# EAGLE design Audio Spektrum Analyser (EAGLE 9.0.1)
ERSTELLER: Jakob Holz; PROJEKT: Audio Spektrumanalysator; VERSION: 1.0

## Sheet 1 of 5
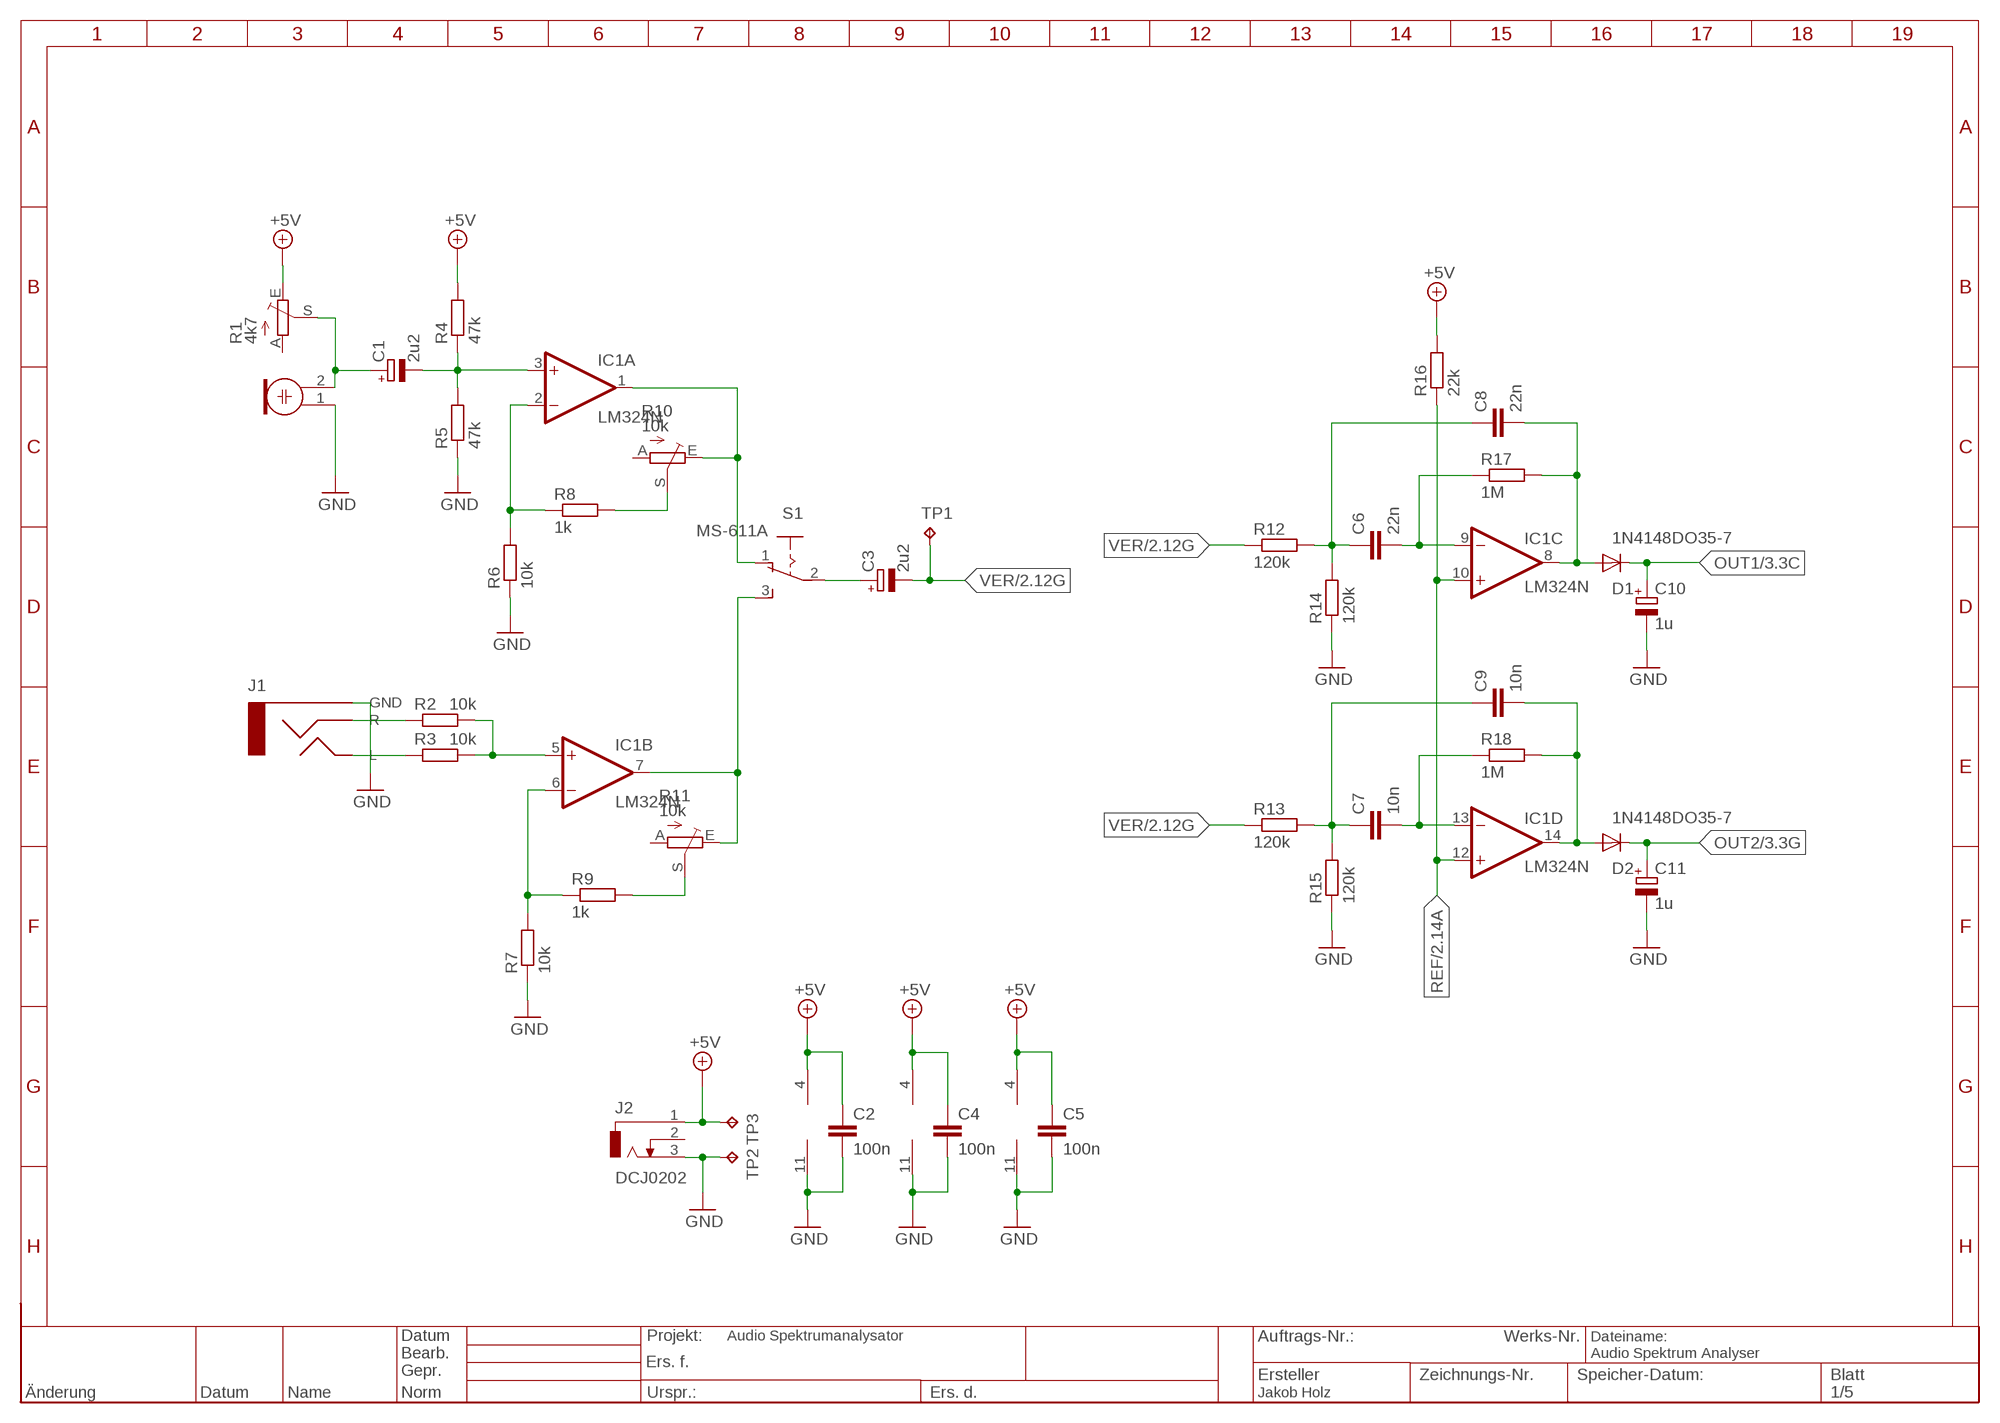
[diagram p0: schematic, sheet 1]

### Parts
C1  2u2  CPOL-EUE2.5-5  [E2,5-5]
C2  100n  C-EU050-024X044  [C050-024X044]
C3  2u2  CPOL-EUE2.5-5  [E2,5-5]
C4  100n  C-EU050-024X044  [C050-024X044]
C5  100n  C-EU050-024X044  [C050-024X044]
C6  22n  C-EU025-024X044  [C025-024X044]
C7  10n  C-EU025-024X044  [C025-024X044]
C8  22n  C-EU025-024X044  [C025-024X044]
C9  10n  C-EU025-024X044  [C025-024X044]
C10  1u  CPOL-EUE2.5-5  [E2,5-5]
C11  1u  CPOL-EUE2.5-5  [E2,5-5]
D1  1N4148DO35-7  [DO35-7]
D2  1N4148DO35-7  [DO35-7]
IC1  LM324N  [DIL14]
IC2  LM324N  [DIL14]
IC3  LM324N  [DIL14]
J1  2.5MM-AUXPC  [2.5MM-AUX_PC]
J2  DCJ0202  [DCJ0202]
M1  ELECTRET_MICROPHON-F6050AP  [F6050AP]
R1  4k7  TRIM_EU-CA6V  [CA6V]
R2  10k  R-EU_0207/7  [0207/7]
R3  10k  R-EU_0207/7  [0207/7]
R4  47k  R-EU_0207/7  [0207/7]
R5  47k  R-EU_0207/7  [0207/7]
R6  10k  R-EU_0207/7  [0207/7]
R7  10k  R-EU_0207/7  [0207/7]
R8  1k  R-EU_0207/7  [0207/7]
R9  1k  R-EU_0207/7  [0207/7]
R10  10k  TRIM_EU-CA6V  [CA6V]
R11  10k  TRIM_EU-CA6V  [CA6V]
R12  120k  R-EU_0207/7  [0207/7]
R13  120k  R-EU_0207/7  [0207/7]
R14  120k  R-EU_0207/7  [0207/7]
R15  120k  R-EU_0207/7  [0207/7]
R16  22k  R-EU_0207/7  [0207/7]
R17  1M  R-EU_0207/7  [0207/7]
R18  1M  R-EU_0207/7  [0207/7]
S1  MS-611A  [MS-611A]
TP1  TPPAD1-20  [P1-20]
TP2  TPPAD1-20  [P1-20]
TP3  TPPAD1-20  [P1-20]

### Nets
+5V: C2.1 C4.1 C5.1 IC1.4(P:V+) IC2.4(P:V+) IC3.4(P:V+) J2.1 R1.E R4.2 R16.2 TP3.TP ; also sheet 3,4,5
GND: C2.2 C4.2 C5.2 C10.- C11.- IC1.11(P:V-) IC2.11(P:V-) IC3.11(P:V-) J1.1(GND) J2.3 M1.1 R5.1 R6.1 R7.1 R14.1 R15.1 TP2.TP ; also sheet 2,3,4,5
N$1: J1.4(R) R2.1
N$2: J1.2(L) R3.1
N$3: IC1.5(B:+IN) R2.2 R3.2
N$4: C1.- IC1.3(A:+IN) R4.1 R5.2
N$5: IC1.2(A:-IN) R6.2 R8.1
N$6: IC1.1(A:OUT) R10.E S1.1
N$10: IC1.7(B:OUT) R11.E S1.3
N$12: C3.+ S1.2
N$13: C1.+ M1.2 R1.S
N$31: R8.2 R10.S
N$44: R9.2 R11.S
N$123: IC1.6(B:-IN) R7.2 R9.1
N$133: C8.2 D1.A IC1.8(C:OUT) R17.2
N$134: C6.2 IC1.9(C:-IN) R17.1
N$136: C6.1 C8.1 R12.2 R14.2
N$138: C9.2 D2.A IC1.14(D:OUT) R18.2
N$139: C7.2 IC1.13(D:-IN) R18.1
N$141: C7.1 C9.1 R13.2 R15.2
OUT1: C10.+ D1.C ; also sheet 3
OUT2: C11.+ D2.C ; also sheet 3
REF: IC1.10(C:+IN) IC1.12(D:+IN) R16.1 ; also sheet 2
VER: C3.- R12.1 R13.1 TP1.TP ; also sheet 2
Unconnected: J2.2 R1.A R10.A R11.A

## Sheet 2 of 5
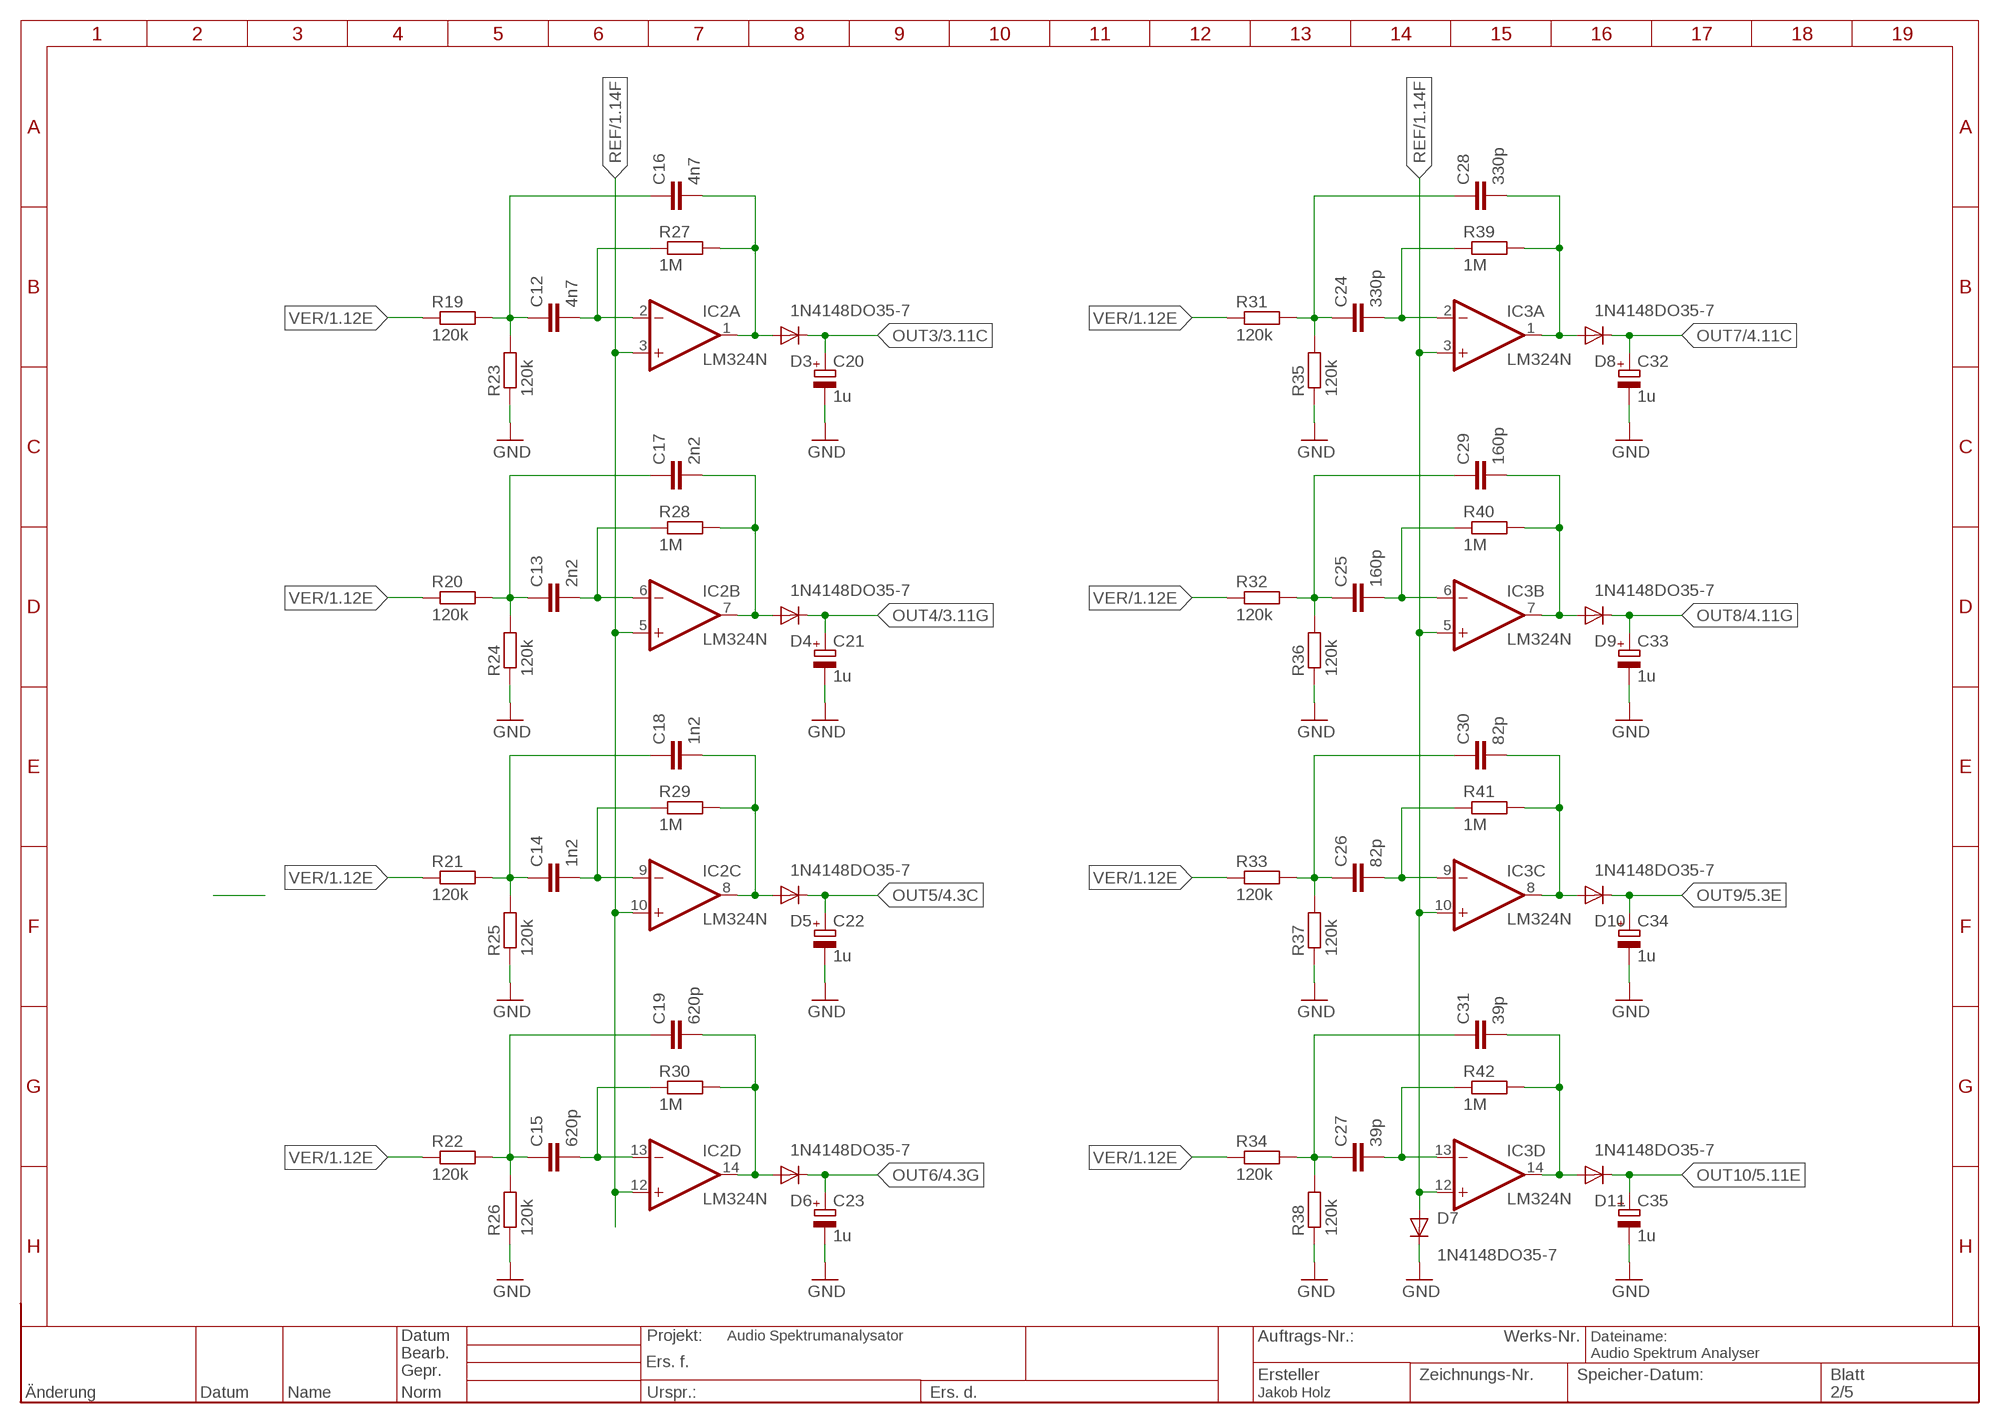
[diagram p1: schematic, sheet 2]

### Parts
C12  4n7  C-EU025-024X044  [C025-024X044]
C13  2n2  C-EU025-024X044  [C025-024X044]
C14  1n2  C-EU025-024X044  [C025-024X044]
C15  620p  C-EU025-024X044  [C025-024X044]
C16  4n7  C-EU025-024X044  [C025-024X044]
C17  2n2  C-EU025-024X044  [C025-024X044]
C18  1n2  C-EU025-024X044  [C025-024X044]
C19  620p  C-EU025-024X044  [C025-024X044]
C20  1u  CPOL-EUE2.5-5  [E2,5-5]
C21  1u  CPOL-EUE2.5-5  [E2,5-5]
C22  1u  CPOL-EUE2.5-5  [E2,5-5]
C23  1u  CPOL-EUE2.5-5  [E2,5-5]
C24  330p  C-EU025-024X044  [C025-024X044]
C25  160p  C-EU025-024X044  [C025-024X044]
C26  82p  C-EU025-024X044  [C025-024X044]
C27  39p  C-EU025-024X044  [C025-024X044]
C28  330p  C-EU025-024X044  [C025-024X044]
C29  160p  C-EU025-024X044  [C025-024X044]
C30  82p  C-EU025-024X044  [C025-024X044]
C31  39p  C-EU025-024X044  [C025-024X044]
C32  1u  CPOL-EUE2.5-5  [E2,5-5]
C33  1u  CPOL-EUE2.5-5  [E2,5-5]
C34  1u  CPOL-EUE2.5-5  [E2,5-5]
C35  1u  CPOL-EUE2.5-5  [E2,5-5]
D3  1N4148DO35-7  [DO35-7]
D4  1N4148DO35-7  [DO35-7]
D5  1N4148DO35-7  [DO35-7]
D6  1N4148DO35-7  [DO35-7]
D7  1N4148DO35-7  [DO35-7]
D8  1N4148DO35-7  [DO35-7]
D9  1N4148DO35-7  [DO35-7]
D10  1N4148DO35-7  [DO35-7]
D11  1N4148DO35-7  [DO35-7]
R19  120k  R-EU_0207/7  [0207/7]
R20  120k  R-EU_0207/7  [0207/7]
R21  120k  R-EU_0207/7  [0207/7]
R22  120k  R-EU_0207/7  [0207/7]
R23  120k  R-EU_0207/7  [0207/7]
R24  120k  R-EU_0207/7  [0207/7]
R25  120k  R-EU_0207/7  [0207/7]
R26  120k  R-EU_0207/7  [0207/7]
R27  1M  R-EU_0207/7  [0207/7]
R28  1M  R-EU_0207/7  [0207/7]
R29  1M  R-EU_0207/7  [0207/7]
R30  1M  R-EU_0207/7  [0207/7]
R31  120k  R-EU_0207/7  [0207/7]
R32  120k  R-EU_0207/7  [0207/7]
R33  120k  R-EU_0207/7  [0207/7]
R34  120k  R-EU_0207/7  [0207/7]
R35  120k  R-EU_0207/7  [0207/7]
R36  120k  R-EU_0207/7  [0207/7]
R37  120k  R-EU_0207/7  [0207/7]
R38  120k  R-EU_0207/7  [0207/7]
R39  1M  R-EU_0207/7  [0207/7]
R40  1M  R-EU_0207/7  [0207/7]
R41  1M  R-EU_0207/7  [0207/7]
R42  1M  R-EU_0207/7  [0207/7]

### Nets
GND: C20.- C21.- C22.- C23.- C32.- C33.- C34.- C35.- D7.C R23.1 R24.1 R25.1 R26.1 R35.1 R36.1 R37.1 R38.1 ; also sheet 1,3,4,5
N$125: C16.2 D3.A IC2.1(A:OUT) R27.2
N$130: C12.2 IC2.2(A:-IN) R27.1
N$135: C19.2 D6.A IC2.14(D:OUT) R30.2
N$140: C12.1 C16.1 R19.2 R23.2
N$144: C17.2 D4.A IC2.7(B:OUT) R28.2
N$145: C13.2 IC2.6(B:-IN) R28.1
N$146: C15.2 IC2.13(D:-IN) R30.1
N$147: C13.1 C17.1 R20.2 R24.2
N$149: C18.2 D5.A IC2.8(C:OUT) R29.2
N$150: C14.2 IC2.9(C:-IN) R29.1
N$151: C28.2 D8.A IC3.1(A:OUT) R39.2
N$152: C14.1 C18.1 R21.2 R25.2
N$154: C15.1 C19.1 R22.2 R26.2
N$156: C24.2 IC3.2(A:-IN) R39.1
N$157: C24.1 C28.1 R31.2 R35.2
N$159: C29.2 D9.A IC3.7(B:OUT) R40.2
N$160: C25.2 IC3.6(B:-IN) R40.1
N$161: C25.1 C29.1 R32.2 R36.2
N$163: C30.2 D10.A IC3.8(C:OUT) R41.2
N$164: C26.2 IC3.9(C:-IN) R41.1
N$165: C26.1 C30.1 R33.2 R37.2
N$167: C31.2 D11.A IC3.14(D:OUT) R42.2
N$168: C27.2 IC3.13(D:-IN) R42.1
N$169: C27.1 C31.1 R34.2 R38.2
OUT3: C20.+ D3.C ; also sheet 3
OUT4: C21.+ D4.C ; also sheet 3
OUT5: C22.+ D5.C ; also sheet 4
OUT6: C23.+ D6.C ; also sheet 4
OUT7: C32.+ D8.C ; also sheet 4
OUT8: C33.+ D9.C ; also sheet 4
OUT9: C34.+ D10.C ; also sheet 5
OUT10: C35.+ D11.C ; also sheet 5
REF: D7.A IC2.3(A:+IN) IC2.5(B:+IN) IC2.10(C:+IN) IC2.12(D:+IN) IC3.3(A:+IN) IC3.5(B:+IN) IC3.10(C:+IN) IC3.12(D:+IN) ; also sheet 1
VER: R19.1 R20.1 R21.1 R22.1 R31.1 R32.1 R33.1 R34.1 ; also sheet 1

## Sheet 3 of 5
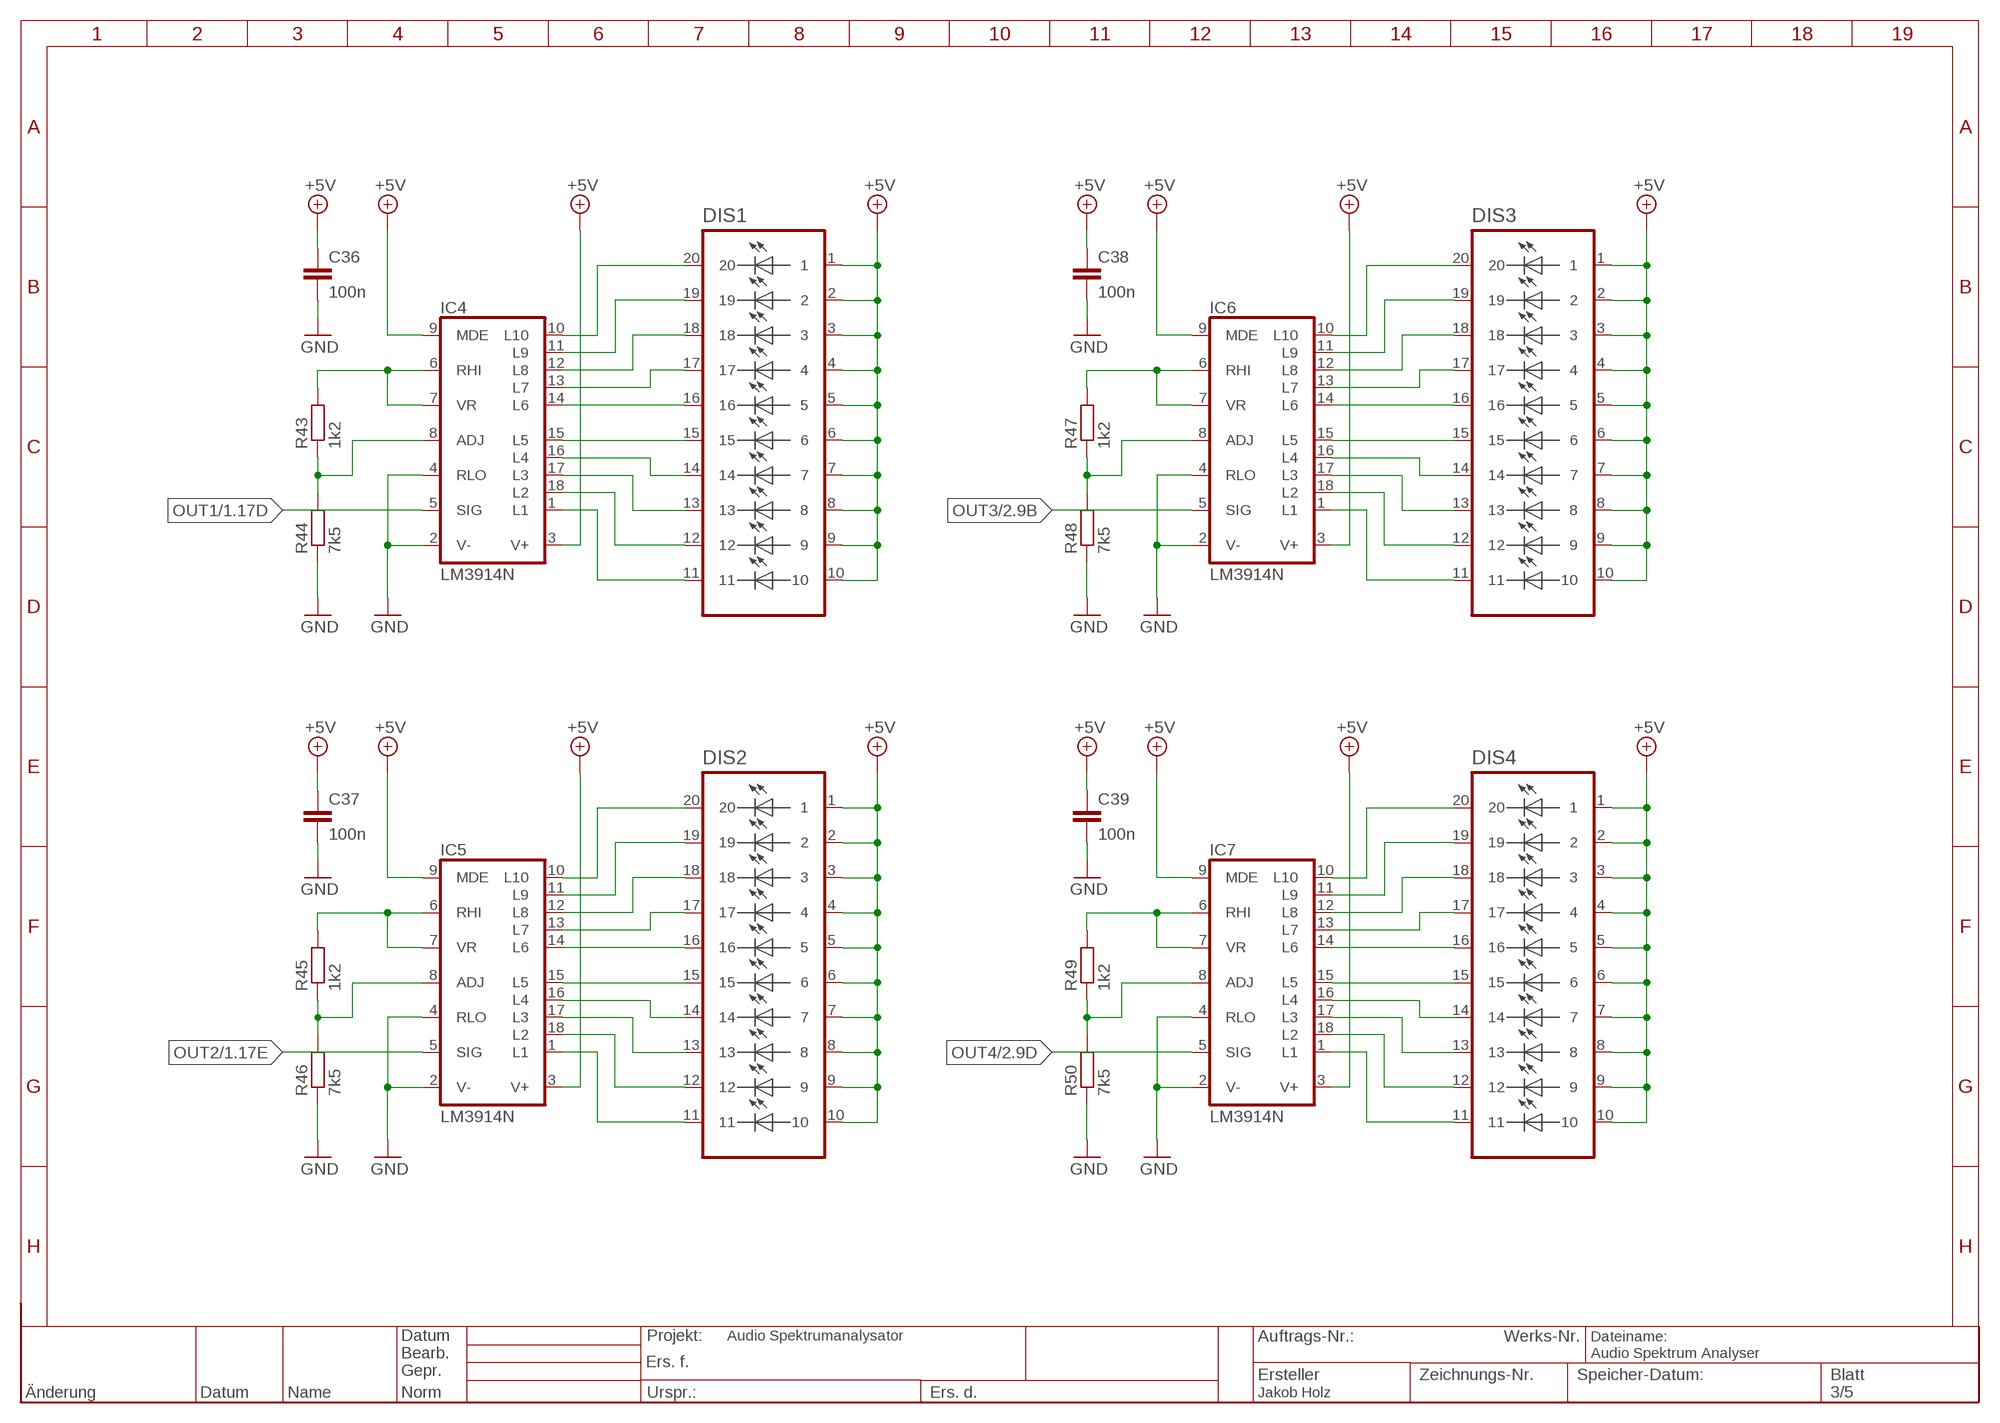
[diagram p2: schematic, sheet 3]

### Parts
C36  100n  C-EU050-024X044  [C050-024X044]
C37  100n  C-EU050-024X044  [C050-024X044]
C38  100n  C-EU050-024X044  [C050-024X044]
C39  100n  C-EU050-024X044  [C050-024X044]
DIS1  SHB10R  [SHB10R]
DIS2  SHB10R  [SHB10R]
DIS3  SHB10R  [SHB10R]
DIS4  SHB10R  [SHB10R]
IC4  LM3914N  [DIL18]
IC5  LM3914N  [DIL18]
IC6  LM3914N  [DIL18]
IC7  LM3914N  [DIL18]
R43  1k2  R-EU_0207/7  [0207/7]
R44  7k5  R-EU_0207/7  [0207/7]
R45  1k2  R-EU_0207/7  [0207/7]
R46  7k5  R-EU_0207/7  [0207/7]
R47  1k2  R-EU_0207/7  [0207/7]
R48  7k5  R-EU_0207/7  [0207/7]
R49  1k2  R-EU_0207/7  [0207/7]
R50  7k5  R-EU_0207/7  [0207/7]

### Nets
+5V: C36.1 C37.1 C38.1 C39.1 DIS1.1 DIS1.2 DIS1.3 DIS1.4 DIS1.5 DIS1.6 DIS1.7 DIS1.8 DIS1.9 DIS1.10 DIS2.1 DIS2.2 DIS2.3 DIS2.4 DIS2.5 DIS2.6 DIS2.7 DIS2.8 DIS2.9 DIS2.10 DIS3.1 DIS3.2 DIS3.3 DIS3.4 DIS3.5 DIS3.6 DIS3.7 DIS3.8 DIS3.9 DIS3.10 DIS4.1 DIS4.2 DIS4.3 DIS4.4 DIS4.5 DIS4.6 DIS4.7 DIS4.8 DIS4.9 DIS4.10 IC4.3(V+) IC4.9(MDE) IC5.3(V+) IC5.9(MDE) IC6.3(V+) IC6.9(MDE) IC7.3(V+) IC7.9(MDE) ; also sheet 1,4,5
GND: C36.2 C37.2 C38.2 C39.2 IC4.2(V-) IC4.4(RLO) IC5.2(V-) IC5.4(RLO) IC6.2(V-) IC6.4(RLO) IC7.2(V-) IC7.4(RLO) R44.1 R46.1 R48.1 R50.1 ; also sheet 1,2,4,5
N$7: DIS3.15 IC6.15(L5)
N$8: DIS3.14 IC6.16(L4)
N$9: DIS3.13 IC6.17(L3)
N$11: DIS3.12 IC6.18(L2)
N$17: DIS3.11 IC6.1(L1)
N$18: DIS3.16 IC6.14(L6)
N$19: DIS3.17 IC6.13(L7)
N$26: DIS3.18 IC6.12(L8)
N$27: DIS3.19 IC6.11(L9)
N$28: DIS3.20 IC6.10(L10)
N$29: IC6.6(RHI) IC6.7(VR) R47.2
N$30: IC6.8(ADJ) R47.1 R48.2
N$32: DIS2.15 IC5.15(L5)
N$33: DIS2.14 IC5.16(L4)
N$34: DIS2.13 IC5.17(L3)
N$35: DIS2.12 IC5.18(L2)
N$36: DIS2.11 IC5.1(L1)
N$37: DIS2.16 IC5.14(L6)
N$38: DIS2.17 IC5.13(L7)
N$39: DIS2.18 IC5.12(L8)
N$40: DIS2.19 IC5.11(L9)
N$41: DIS2.20 IC5.10(L10)
N$42: IC5.6(RHI) IC5.7(VR) R45.2
N$43: IC5.8(ADJ) R45.1 R46.2
N$45: DIS4.15 IC7.15(L5)
N$46: DIS4.14 IC7.16(L4)
N$47: DIS4.13 IC7.17(L3)
N$48: DIS4.12 IC7.18(L2)
N$49: DIS4.11 IC7.1(L1)
N$50: DIS4.16 IC7.14(L6)
N$51: DIS4.17 IC7.13(L7)
N$52: DIS4.18 IC7.12(L8)
N$53: DIS4.19 IC7.11(L9)
N$54: DIS4.20 IC7.10(L10)
N$55: IC7.6(RHI) IC7.7(VR) R49.2
N$56: IC7.8(ADJ) R49.1 R50.2
N$97: DIS1.15 IC4.15(L5)
N$98: DIS1.14 IC4.16(L4)
N$99: DIS1.13 IC4.17(L3)
N$100: DIS1.12 IC4.18(L2)
N$101: DIS1.11 IC4.1(L1)
N$102: DIS1.16 IC4.14(L6)
N$103: DIS1.17 IC4.13(L7)
N$104: DIS1.18 IC4.12(L8)
N$105: DIS1.19 IC4.11(L9)
N$106: DIS1.20 IC4.10(L10)
N$107: IC4.6(RHI) IC4.7(VR) R43.2
N$108: IC4.8(ADJ) R43.1 R44.2
OUT1: IC4.5(SIG) ; also sheet 1
OUT2: IC5.5(SIG) ; also sheet 1
OUT3: IC6.5(SIG) ; also sheet 2
OUT4: IC7.5(SIG) ; also sheet 2

## Sheet 4 of 5
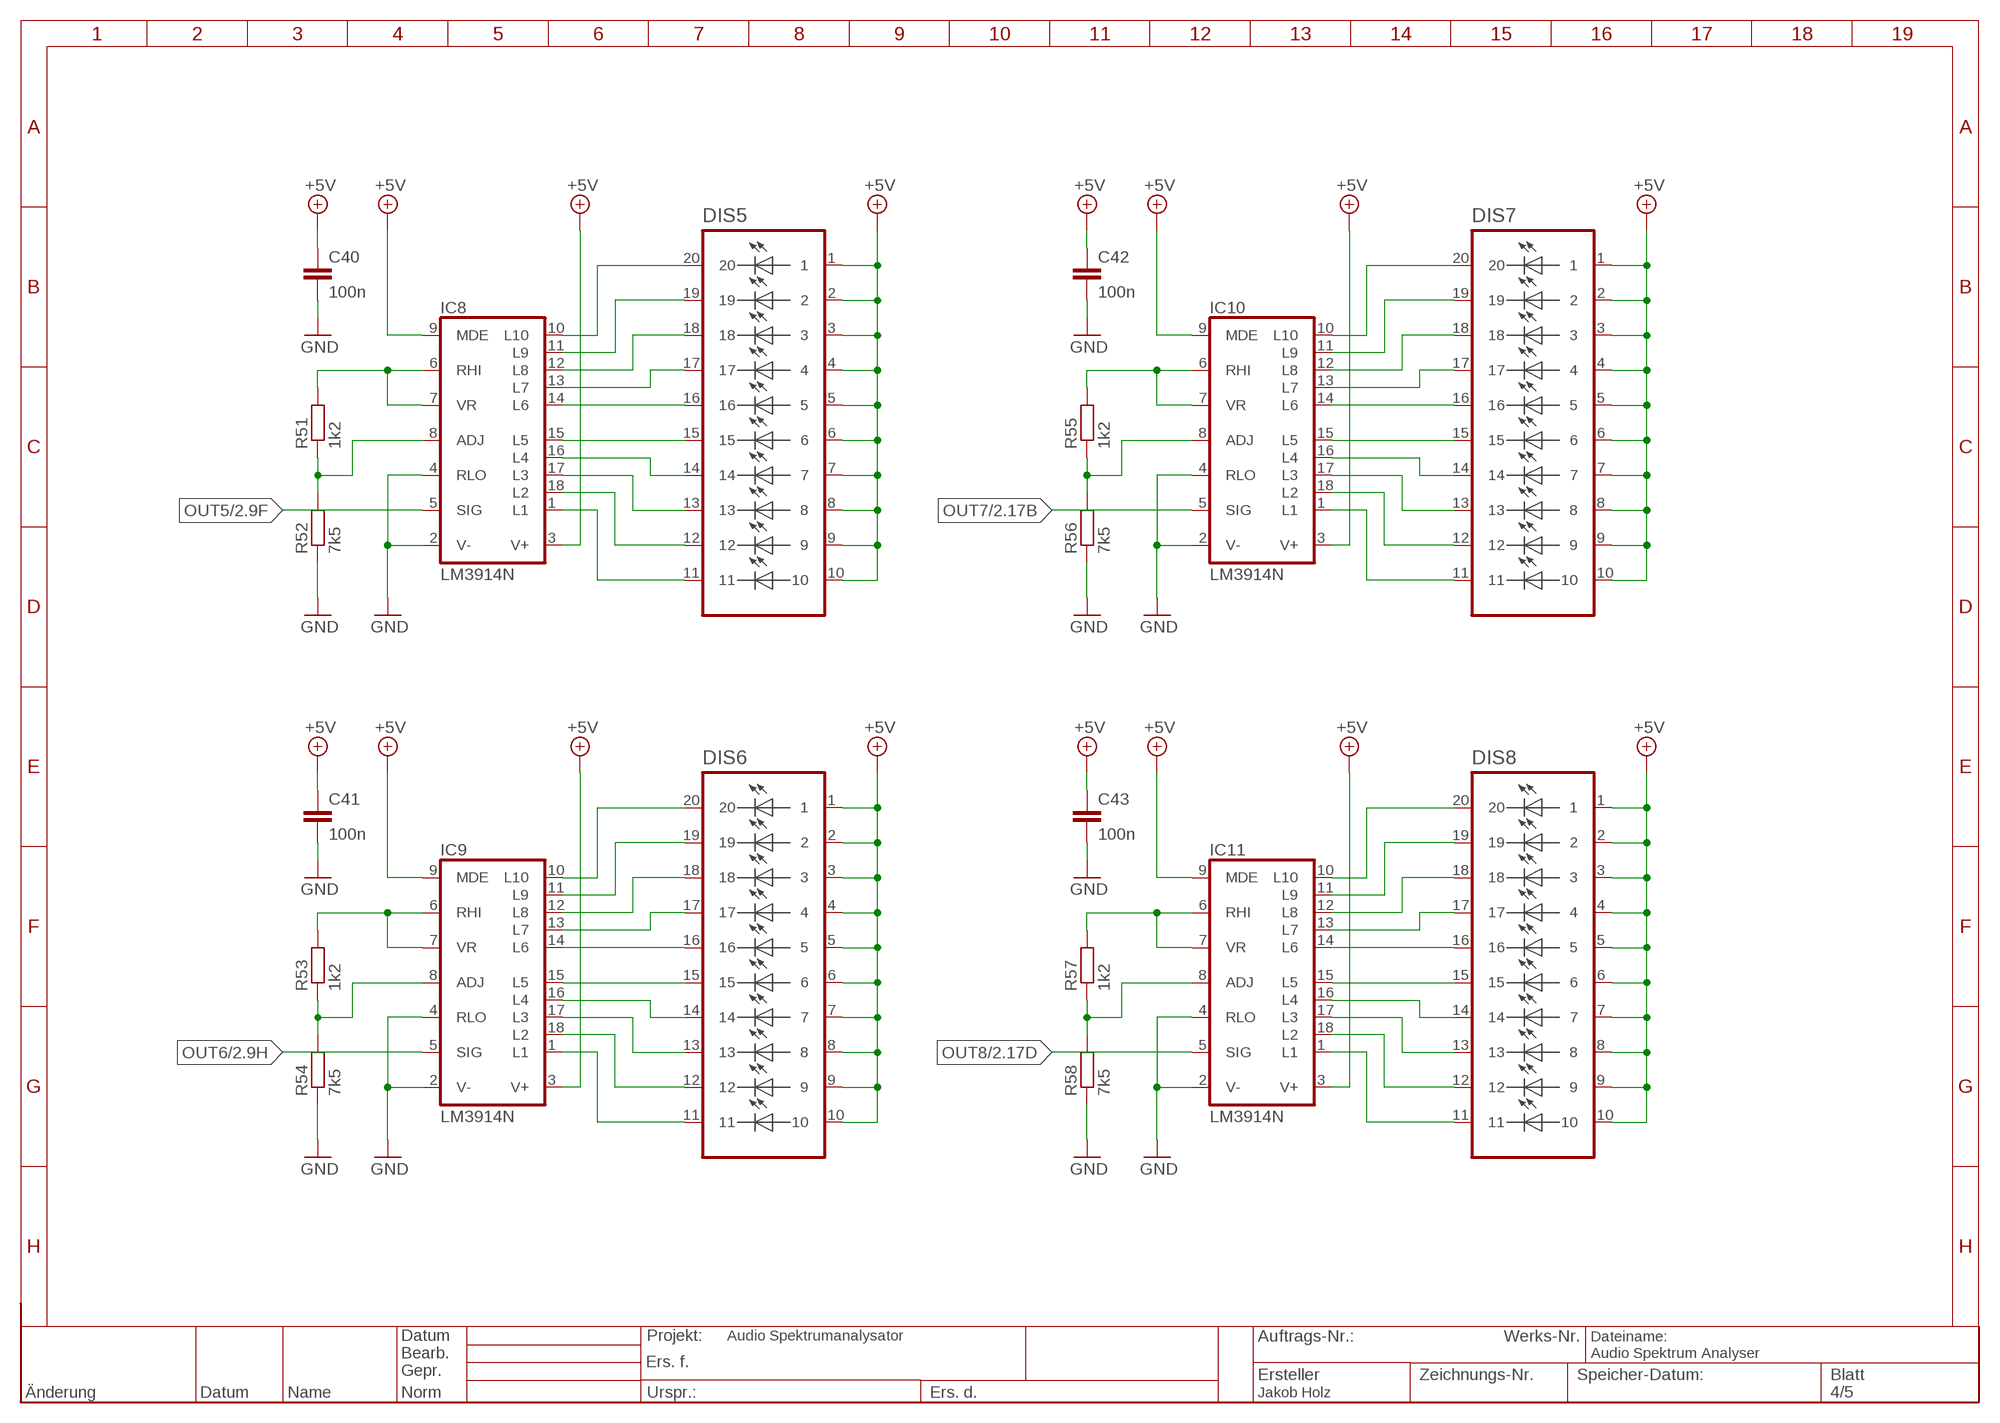
[diagram p3: schematic, sheet 4]

### Parts
C40  100n  C-EU050-024X044  [C050-024X044]
C41  100n  C-EU050-024X044  [C050-024X044]
C42  100n  C-EU050-024X044  [C050-024X044]
C43  100n  C-EU050-024X044  [C050-024X044]
DIS5  SHB10R  [SHB10R]
DIS6  SHB10R  [SHB10R]
DIS7  SHB10R  [SHB10R]
DIS8  SHB10R  [SHB10R]
IC8  LM3914N  [DIL18]
IC9  LM3914N  [DIL18]
IC10  LM3914N  [DIL18]
IC11  LM3914N  [DIL18]
R51  1k2  R-EU_0207/7  [0207/7]
R52  7k5  R-EU_0207/7  [0207/7]
R53  1k2  R-EU_0207/7  [0207/7]
R54  7k5  R-EU_0207/7  [0207/7]
R55  1k2  R-EU_0207/7  [0207/7]
R56  7k5  R-EU_0207/7  [0207/7]
R57  1k2  R-EU_0207/7  [0207/7]
R58  7k5  R-EU_0207/7  [0207/7]

### Nets
+5V: C40.1 C41.1 C42.1 C43.1 DIS5.1 DIS5.2 DIS5.3 DIS5.4 DIS5.5 DIS5.6 DIS5.7 DIS5.8 DIS5.9 DIS5.10 DIS6.1 DIS6.2 DIS6.3 DIS6.4 DIS6.5 DIS6.6 DIS6.7 DIS6.8 DIS6.9 DIS6.10 DIS7.1 DIS7.2 DIS7.3 DIS7.4 DIS7.5 DIS7.6 DIS7.7 DIS7.8 DIS7.9 DIS7.10 DIS8.1 DIS8.2 DIS8.3 DIS8.4 DIS8.5 DIS8.6 DIS8.7 DIS8.8 DIS8.9 DIS8.10 IC8.3(V+) IC8.9(MDE) IC9.3(V+) IC9.9(MDE) IC10.3(V+) IC10.9(MDE) IC11.3(V+) IC11.9(MDE) ; also sheet 1,3,5
GND: C40.2 C41.2 C42.2 C43.2 IC8.2(V-) IC8.4(RLO) IC9.2(V-) IC9.4(RLO) IC10.2(V-) IC10.4(RLO) IC11.2(V-) IC11.4(RLO) R52.1 R54.1 R56.1 R58.1 ; also sheet 1,2,3,5
N$58: DIS5.15 IC8.15(L5)
N$59: DIS5.14 IC8.16(L4)
N$60: DIS5.13 IC8.17(L3)
N$61: DIS5.12 IC8.18(L2)
N$62: DIS5.11 IC8.1(L1)
N$63: DIS5.16 IC8.14(L6)
N$64: DIS5.17 IC8.13(L7)
N$65: DIS5.18 IC8.12(L8)
N$66: DIS5.19 IC8.11(L9)
N$67: DIS5.20 IC8.10(L10)
N$68: IC8.6(RHI) IC8.7(VR) R51.2
N$69: IC8.8(ADJ) R51.1 R52.2
N$71: DIS7.15 IC10.15(L5)
N$72: DIS7.14 IC10.16(L4)
N$73: DIS7.13 IC10.17(L3)
N$74: DIS7.12 IC10.18(L2)
N$75: DIS7.11 IC10.1(L1)
N$76: DIS7.16 IC10.14(L6)
N$77: DIS7.17 IC10.13(L7)
N$78: DIS7.18 IC10.12(L8)
N$79: DIS7.19 IC10.11(L9)
N$80: DIS7.20 IC10.10(L10)
N$81: IC10.6(RHI) IC10.7(VR) R55.2
N$82: IC10.8(ADJ) R55.1 R56.2
N$84: DIS6.15 IC9.15(L5)
N$85: DIS6.14 IC9.16(L4)
N$86: DIS6.13 IC9.17(L3)
N$87: DIS6.12 IC9.18(L2)
N$88: DIS6.11 IC9.1(L1)
N$89: DIS6.16 IC9.14(L6)
N$90: DIS6.17 IC9.13(L7)
N$91: DIS6.18 IC9.12(L8)
N$92: DIS6.19 IC9.11(L9)
N$93: DIS6.20 IC9.10(L10)
N$94: IC9.6(RHI) IC9.7(VR) R53.2
N$95: IC9.8(ADJ) R53.1 R54.2
N$110: DIS8.15 IC11.15(L5)
N$111: DIS8.14 IC11.16(L4)
N$112: DIS8.13 IC11.17(L3)
N$113: DIS8.12 IC11.18(L2)
N$114: DIS8.11 IC11.1(L1)
N$115: DIS8.16 IC11.14(L6)
N$116: DIS8.17 IC11.13(L7)
N$117: DIS8.18 IC11.12(L8)
N$118: DIS8.19 IC11.11(L9)
N$119: DIS8.20 IC11.10(L10)
N$120: IC11.6(RHI) IC11.7(VR) R57.2
N$121: IC11.8(ADJ) R57.1 R58.2
OUT5: IC8.5(SIG) ; also sheet 2
OUT6: IC9.5(SIG) ; also sheet 2
OUT7: IC10.5(SIG) ; also sheet 2
OUT8: IC11.5(SIG) ; also sheet 2

## Sheet 5 of 5
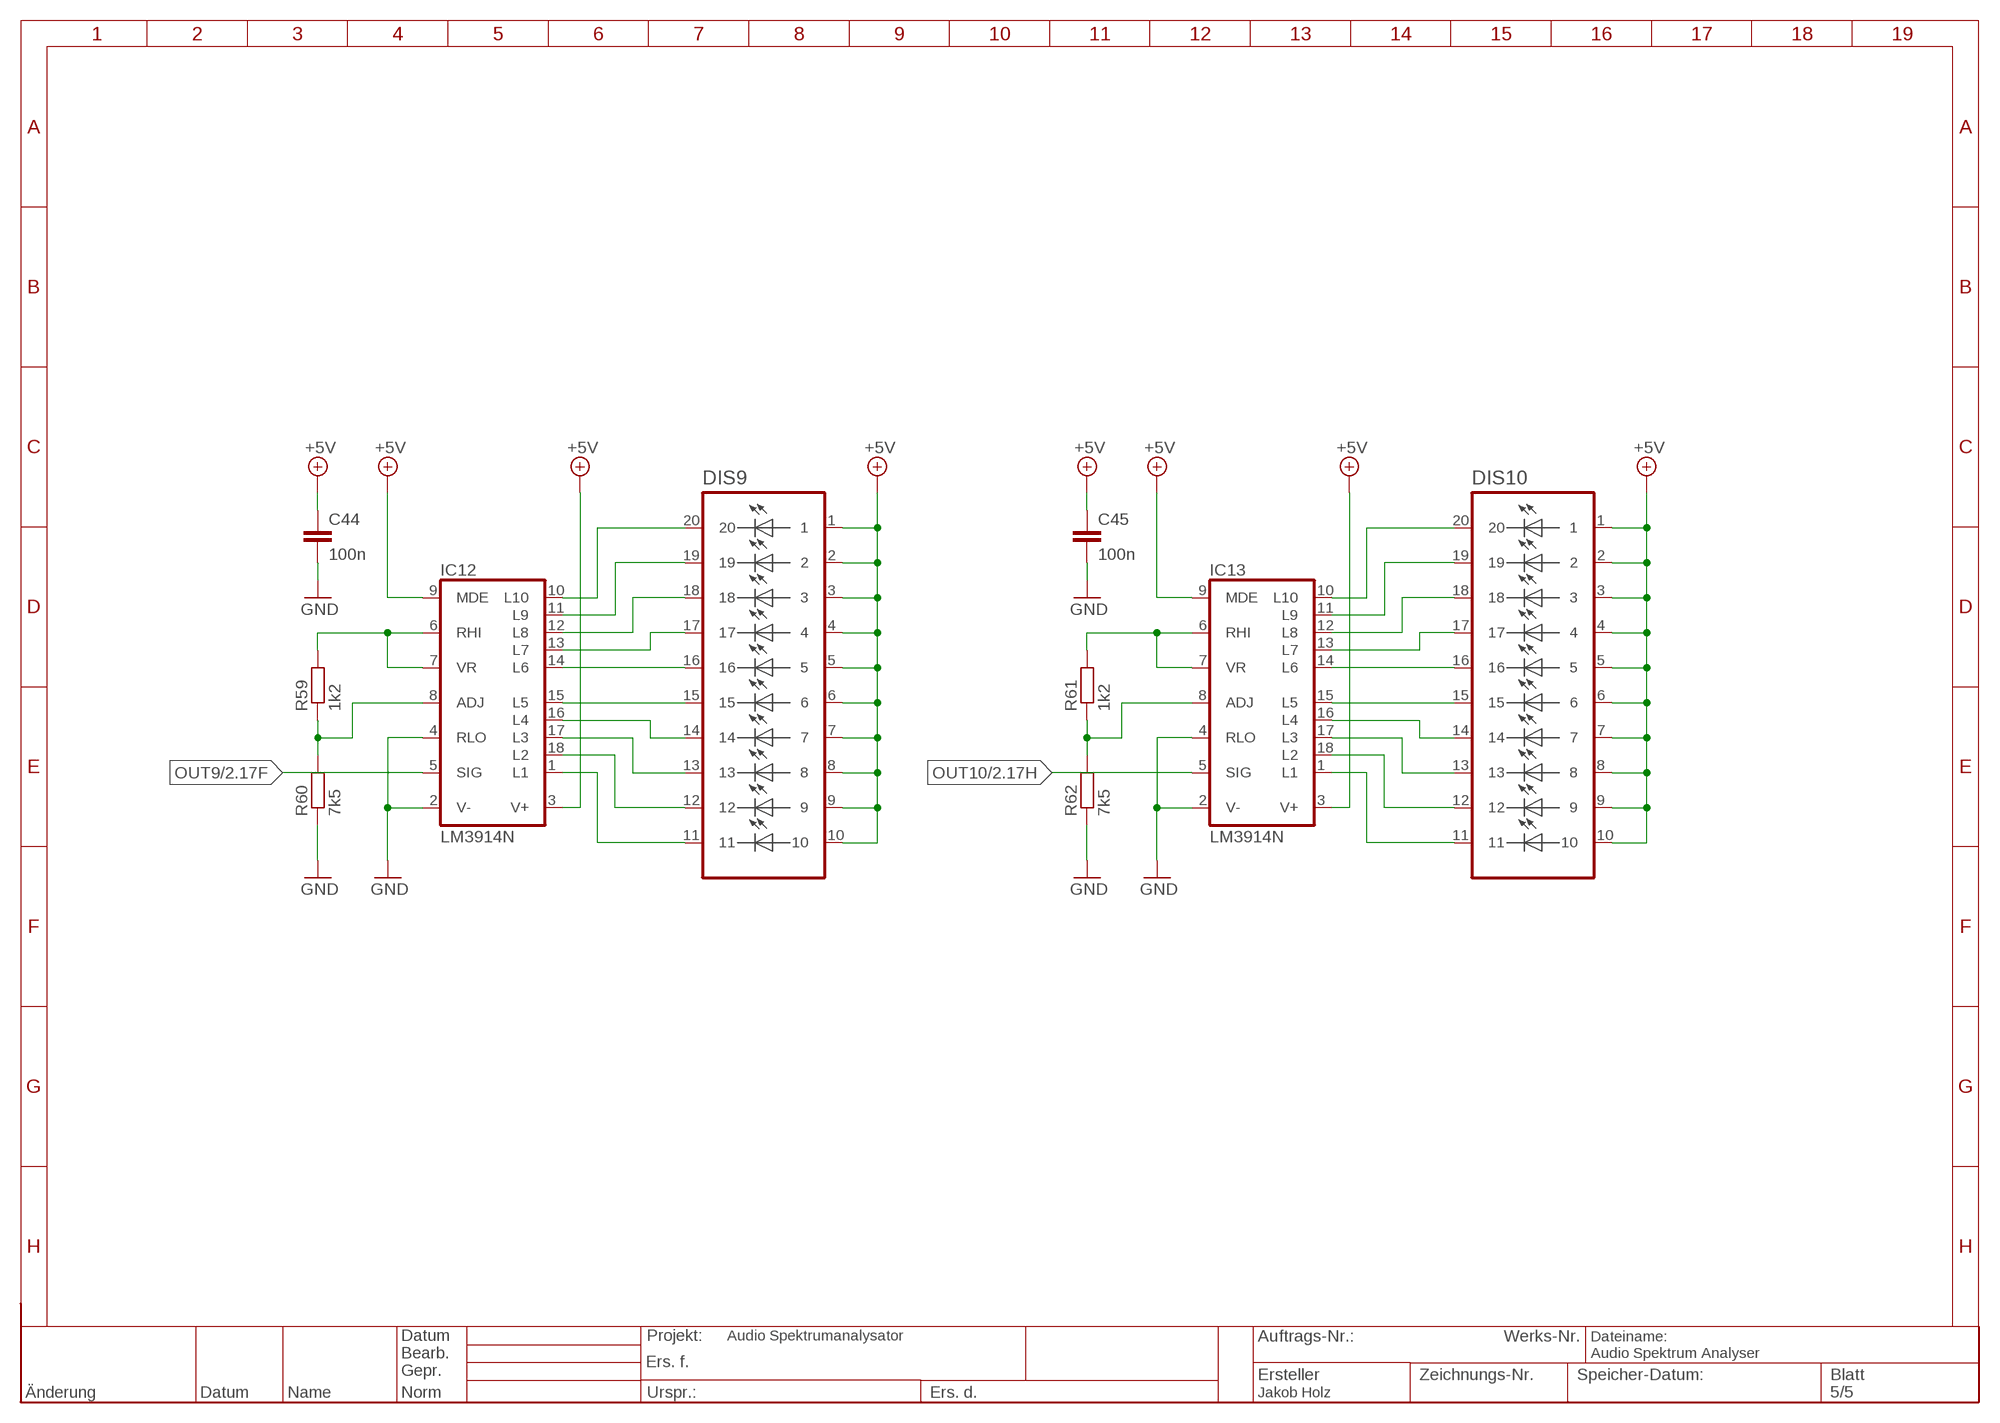
[diagram p4: schematic, sheet 5]

### Parts
C44  100n  C-EU050-024X044  [C050-024X044]
C45  100n  C-EU050-024X044  [C050-024X044]
DIS9  SHB10R  [SHB10R]
DIS10  SHB10R  [SHB10R]
IC12  LM3914N  [DIL18]
IC13  LM3914N  [DIL18]
R59  1k2  R-EU_0207/7  [0207/7]
R60  7k5  R-EU_0207/7  [0207/7]
R61  1k2  R-EU_0207/7  [0207/7]
R62  7k5  R-EU_0207/7  [0207/7]

### Nets
+5V: C44.1 C45.1 DIS9.1 DIS9.2 DIS9.3 DIS9.4 DIS9.5 DIS9.6 DIS9.7 DIS9.8 DIS9.9 DIS9.10 DIS10.1 DIS10.2 DIS10.3 DIS10.4 DIS10.5 DIS10.6 DIS10.7 DIS10.8 DIS10.9 DIS10.10 IC12.3(V+) IC12.9(MDE) IC13.3(V+) IC13.9(MDE) ; also sheet 1,3,4
GND: C44.2 C45.2 IC12.2(V-) IC12.4(RLO) IC13.2(V-) IC13.4(RLO) R60.1 R62.1 ; also sheet 1,2,3,4
N$14: DIS9.15 IC12.15(L5)
N$15: DIS9.14 IC12.16(L4)
N$16: DIS9.13 IC12.17(L3)
N$20: DIS9.12 IC12.18(L2)
N$21: DIS9.11 IC12.1(L1)
N$22: DIS9.16 IC12.14(L6)
N$23: DIS9.17 IC12.13(L7)
N$24: DIS9.18 IC12.12(L8)
N$25: DIS9.19 IC12.11(L9)
N$126: DIS9.20 IC12.10(L10)
N$127: IC12.6(RHI) IC12.7(VR) R59.2
N$128: IC12.8(ADJ) R59.1 R60.2
N$131: DIS10.15 IC13.15(L5)
N$132: DIS10.14 IC13.16(L4)
N$171: DIS10.13 IC13.17(L3)
N$172: DIS10.12 IC13.18(L2)
N$173: DIS10.11 IC13.1(L1)
N$174: DIS10.16 IC13.14(L6)
N$175: DIS10.17 IC13.13(L7)
N$176: DIS10.18 IC13.12(L8)
N$177: DIS10.19 IC13.11(L9)
N$178: DIS10.20 IC13.10(L10)
N$179: IC13.6(RHI) IC13.7(VR) R61.2
N$180: IC13.8(ADJ) R61.1 R62.2
OUT9: IC12.5(SIG) ; also sheet 2
OUT10: IC13.5(SIG) ; also sheet 2

## Library data of the parts
C1 C3 C10 C11 C20-C23 C32-C35 = resistor:CPOL-EU: POLARIZED CAPACITOR, European symbol
C2 C4-C9 C12-C19 C24-C31 C36-C45 = resistor:C-EU: CAPACITOR, European symbol
D1-D11 = diode:1N4148: DIODE high speed (Philips)
DIS1-DIS10 = Jakobs_LBR:SHB10R: The SHB10R is a 10 segment led graph display.
IC1-IC3 = linear:LM324: OP AMP
IC4-IC13 = linear:LM3914N: LED DRIVER senses analog voltage levels and drives 10 LEDs
J1 = Jakobs_LBR:2.5MM-AUX
J2 = con-jack:DCJ0202: DC POWER JACK Source: DCJ0202.pdf; OC_FARNELL: unknown; OC_NEWARK: unknown
M1 = microphon:ELECTRET_MICROPHON-: Electret Condenser Microphone
R1 R10 R11 = pot:TRIM_EU-: POTENTIOMETER
R2-R6 R8 = rcl:R-EU_: RESISTOR, European symbol; SPICEPREFIX: R
R7 R9 R12-R62 = resistor:R-EU_: RESISTOR, European symbol
S1 = 1_Robo-Lib:MS-611A: 610-series mini-sized toggle switch made for low current (0.3A, 125V, AC) PC board use. Switching ON-ON. Featuring standard 2.54 mm pinpitch, 0.75 mm pinwidth, 6 mm width, 9 mm length and 23 mm height.; LENGTH: 9mm; PINPITCH: 2.54mm; WIDTH: 6mm
TP1-TP3 = testpad:TP: Test pad

## Board
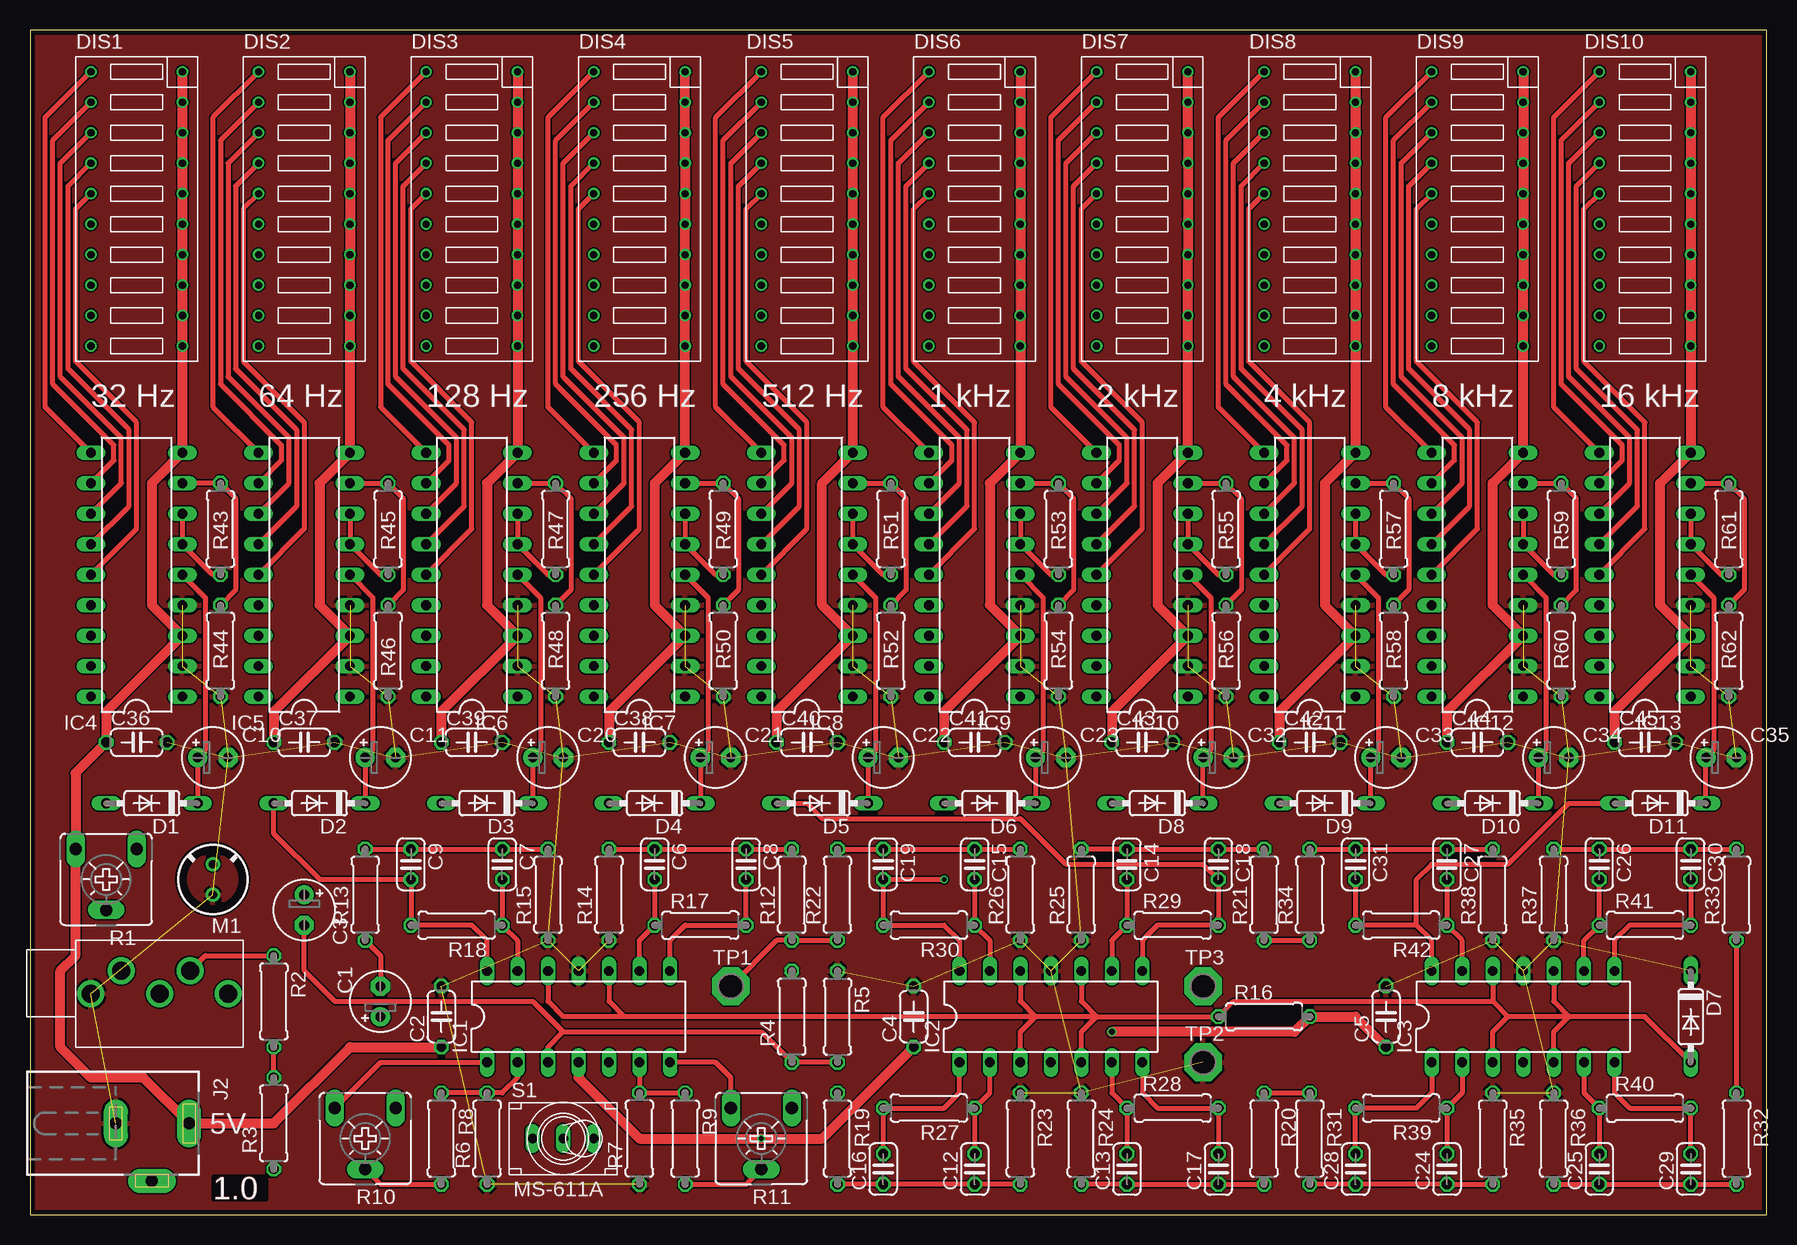
[diagram p5: board, top side]
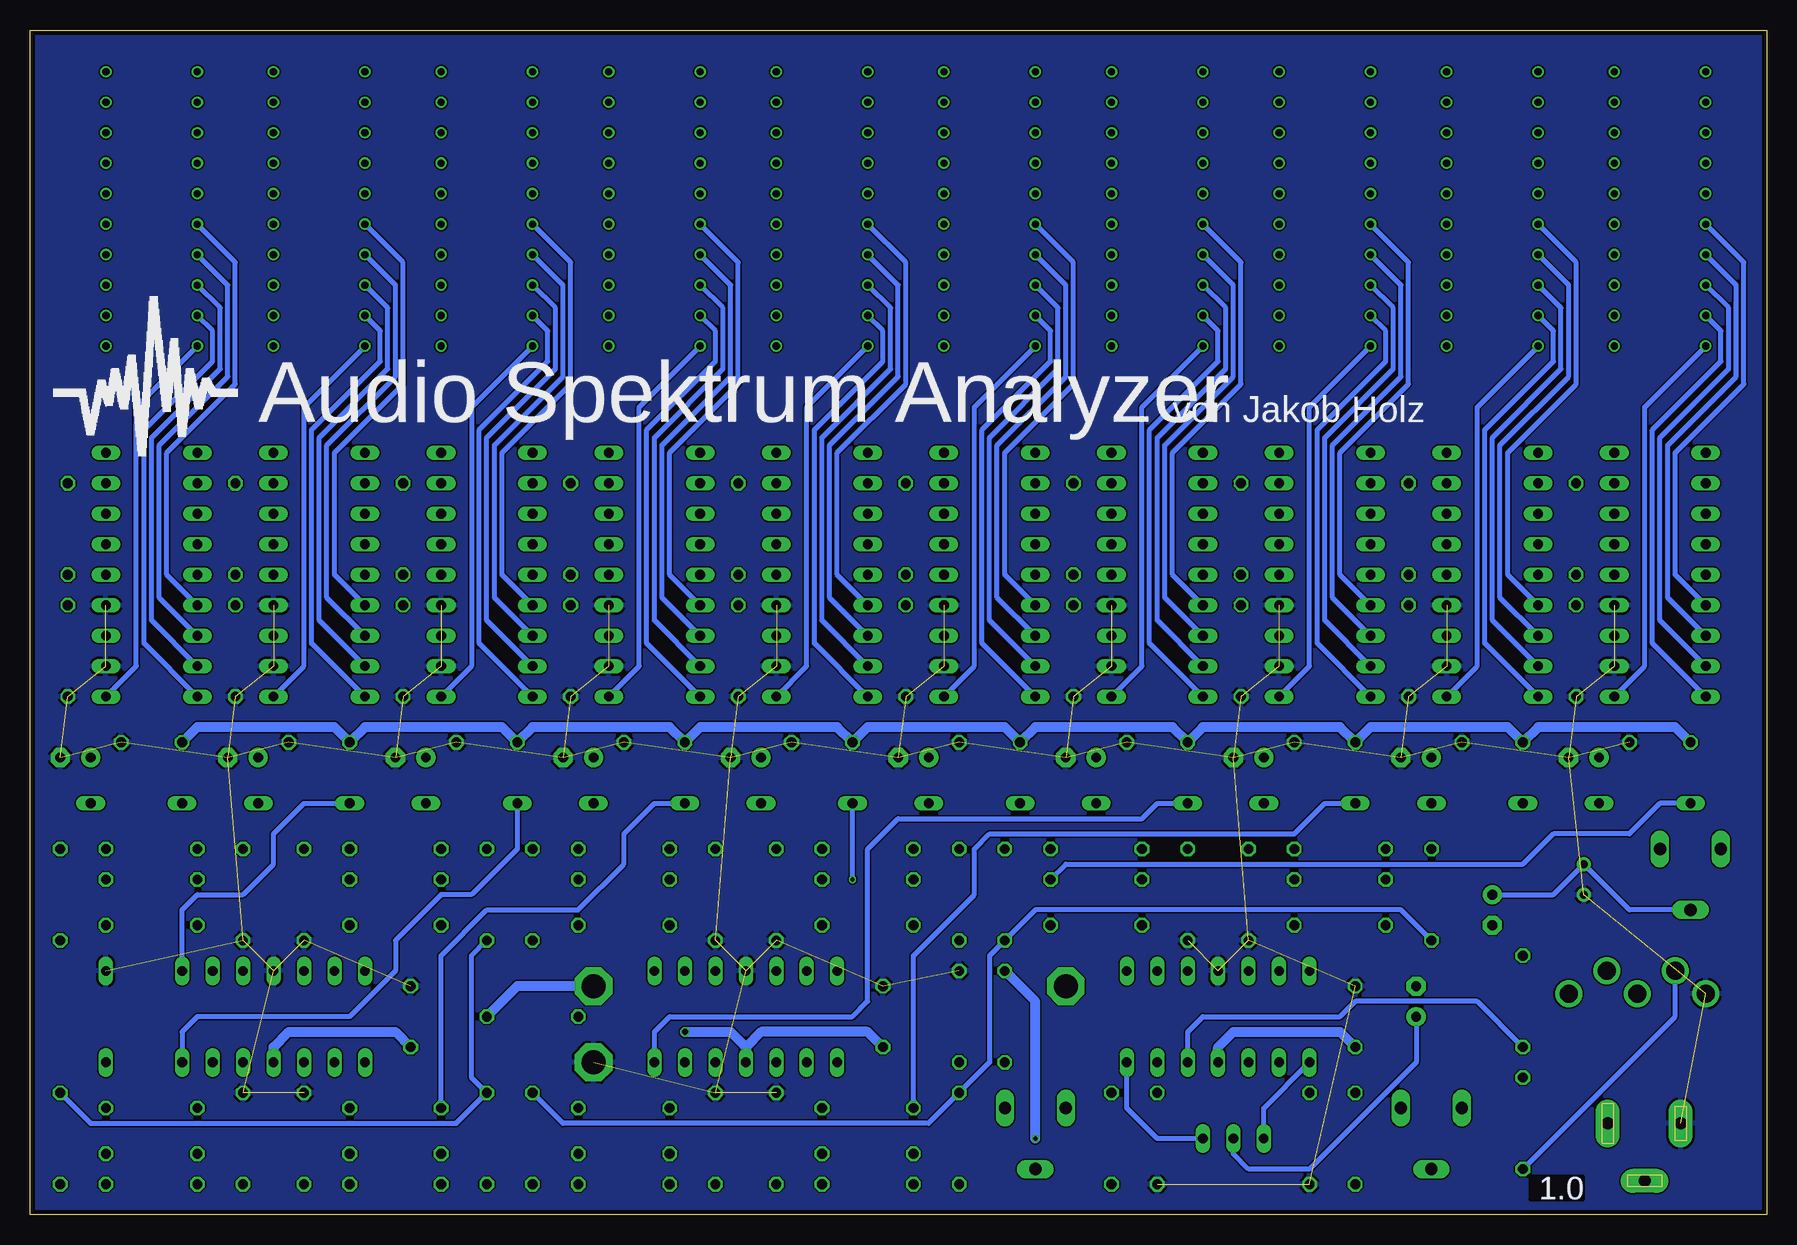
[diagram p6: board, bottom side, seen from below]

Size 144.76 x 98.73 mm. Coordinates in mm from the lower left corner, seen from the top.
Outline: 0,0 144.76,0 144.76,98.73 0,98.73 0,0
Copper layers (1*16): Top 0.018mm / dielectric 1.55mm / Bottom 0.018mm
Design rules "JLC_2Layer_PCB": minimum track width 5mil, minimum drill 0.2mm, track to track 5mil, track to pad 5mil, pad to pad 5mil, via to via 5mil, smd to smd 0mil, copper to edge 0.4mm, drill to drill 0.4mm, minimum pad ring 0.175mm, minimum via ring 0.125mm, stop-mask expansion 0mil, vias tented up to drill 0.45mm, thermal gap 0.2mm

### Footprints (pad centres in the part's own frame; a part is rotated, then mirrored left to right if it is on the bottom)
E2,5-5 = drill 0.813 pad 1.6: + -1.27,0 | drill 0.813 pad 1.6 octagon: - 1.27,0
C050-024X044 = drill 0.813 octagon: 1 -2.54,0; 2 2.54,0
C025-024X044 = drill 0.813 octagon: 1 -1.27,0; 2 1.27,0
DO35-7 = drill 0.813 long: A 3.81,0; C -3.81,0
SHB10R = drill 0.6: 1 8.89,24.13; 2 8.89,21.59; 3 8.89,19.05; 4 8.89,16.51; 5 8.89,13.97; 6 8.89,11.43; 7 8.89,8.89; 8 8.89,6.35; 9 8.89,3.81; 10 8.89,1.27; 11 1.27,1.27; 12 1.27,3.81; 13 1.27,6.35; 14 1.27,8.89; 15 1.27,11.43; 16 1.27,13.97; 17 1.27,16.51; 18 1.27,19.05; 19 1.27,21.59; 20 1.27,24.13
DIL14 = drill 0.813 long: 1 -7.62,-3.81; 2 -5.08,-3.81; 3 -2.54,-3.81; 4 0,-3.81; 5 2.54,-3.81; 6 5.08,-3.81; 7 7.62,-3.81; 8 7.62,3.81; 9 5.08,3.81; 10 2.54,3.81; 11 0,3.81; 12 -2.54,3.81; 13 -5.08,3.81; 14 -7.62,3.81
DIL18 = drill 0.813 long: 1 -10.16,-3.81; 2 -7.62,-3.81; 3 -5.08,-3.81; 4 -2.54,-3.81; 5 0,-3.81; 6 2.54,-3.81; 7 5.08,-3.81; 8 7.62,-3.81; 9 10.16,-3.81; 10 10.16,3.81; 11 7.62,3.81; 12 5.08,3.81; 13 2.54,3.81; 14 0,3.81; 15 -2.54,3.81; 16 -5.08,3.81; 17 -7.62,3.81; 18 -10.16,3.81
2.5MM-AUX_PC = drill 1.5: 1 4.445,1.27; 2 2.54,3.81; 3 4.445,6.985; 4 2.54,9.525; 5 4.445,12.7
DCJ0202 = drill 1 pad 2 long: 1 0,3.1; 2 4.8,0; 3 0,-3
F6050AP = drill 0.7 pad 1.2: 1 0,1.27; 2 0,-1.27
CA6V = drill 1.016 long: A -2.54,-2.54; E 2.54,-2.54; S 0,2.54
0207/7 = drill 0.813 octagon: 1 -3.81,0; 2 3.81,0
MS-611A = drill 0.8 long: 1 -2.54,0; 2 0,0; 3 2.54,0
P1-20 = drill 2.007 pad 3.15 octagon: TP 0,0

### Placement (x,y rotation side)
C1  22.86,25.4 270 top
C2  34.29,16.51 90 top
C3  29.21,17.78 90 top
C4  73.66,16.51 90 top
C5  113.03,16.51 90 top
C6  52.07,29.21 270 top
C7  39.37,29.21 270 top
C8  59.69,29.21 270 top
C9  31.75,29.21 270 top
C10  15.24,38.1 0 top
C11  29.21,38.1 0 top
C12  78.74,3.81 90 top
C13  91.44,3.81 90 top
C14  91.44,29.21 270 top
C15  78.74,29.21 270 top
C16  71.12,3.81 90 top
C17  99.06,3.81 90 top
C18  99.06,29.21 270 top
C19  71.12,29.21 270 top
C20  43.18,38.1 0 top
C21  57.15,38.1 0 top
C22  71.12,38.1 0 top
C23  85.09,38.1 0 top
C24  118.11,3.81 90 top
C25  130.81,3.81 90 top
C26  130.81,29.21 270 top
C27  118.11,29.21 270 top
C28  110.49,3.81 90 top
C29  138.43,3.81 90 top
C30  138.43,29.21 270 top
C31  110.49,29.21 270 top
C32  99.06,38.1 0 top
C33  113.03,38.1 0 top
C34  127,38.1 0 top
C35  140.97,38.1 0 top
C36  8.89,39.37 0 top
C37  22.86,39.37 0 top
C38  50.8,39.37 0 top
C39  36.83,39.37 0 top
C40  64.77,39.37 0 top
C41  78.74,39.37 0 top
C42  106.68,39.37 0 top
C43  92.71,39.37 0 top
C44  120.65,39.37 0 top
C45  134.62,39.37 0 top
D1  10.16,34.29 180 top
D2  24.13,34.29 180 top
D3  38.1,34.29 180 top
D4  52.07,34.29 180 top
D5  66.04,34.29 180 top
D6  80.01,34.29 180 top
D7  138.43,16.51 270 top
D8  93.98,34.29 180 top
D9  107.95,34.29 180 top
D10  121.92,34.29 180 top
D11  135.89,34.29 180 top
DIS1  3.81,71.12 0 top
DIS2  17.78,71.12 0 top
DIS3  31.75,71.12 0 top
DIS4  45.72,71.12 0 top
DIS5  59.69,71.12 0 top
DIS6  73.66,71.12 0 top
DIS7  87.63,71.12 0 top
DIS8  101.6,71.12 0 top
DIS9  115.57,71.12 0 top
DIS10  129.54,71.12 0 top
IC1  45.72,16.51 0 top
IC2  85.09,16.51 0 top
IC3  124.46,16.51 0 top
IC4  8.89,53.34 90 top
IC5  22.86,53.34 90 top
IC6  36.83,53.34 90 top
IC7  50.8,53.34 90 top
IC8  64.77,53.34 90 top
IC9  78.74,53.34 90 top
IC10  92.71,53.34 90 top
IC11  106.68,53.34 90 top
IC12  120.65,53.34 90 top
IC13  134.62,53.34 90 top
J1  3.81,22.86 270 top
J2  10.16,7.62 270 top
M1  15.24,27.94 180 top
R1  6.35,27.94 180 top
R2  20.32,17.78 270 top
R3  20.32,7.62 90 top
R4  63.5,16.51 90 top
R5  67.31,16.51 270 top
R6  38.1,6.35 90 top
R7  50.8,6.35 90 top
R8  34.29,6.35 270 top
R9  54.61,6.35 270 top
R10  27.94,6.35 180 top
R11  60.96,6.35 180 top
R12  63.5,26.67 90 top
R13  27.94,26.67 90 top
R14  48.26,26.67 90 top
R15  43.18,26.67 90 top
R16  102.87,16.51 0 top
R17  55.88,24.13 0 top
R18  35.56,24.13 180 top
R19  67.31,6.35 270 top
R20  102.87,6.35 270 top
R21  102.87,26.67 90 top
R22  67.31,26.67 90 top
R23  82.55,6.35 270 top
R24  87.63,6.35 270 top
R25  87.63,26.67 90 top
R26  82.55,26.67 90 top
R27  74.93,8.89 180 top
R28  95.25,8.89 0 top
R29  95.25,24.13 0 top
R30  74.93,24.13 180 top
R31  106.68,6.35 270 top
R32  142.24,6.35 270 top
R33  142.24,26.67 90 top
R34  106.68,26.67 90 top
R35  121.92,6.35 270 top
R36  127,6.35 270 top
R37  127,26.67 90 top
R38  121.92,26.67 90 top
R39  114.3,8.89 180 top
R40  134.62,8.89 0 top
R41  134.62,24.13 0 top
R42  114.3,24.13 180 top
R43  15.88,57.15 270 top
R44  15.88,46.99 90 top
R45  29.84,57.15 270 top
R46  29.84,46.99 90 top
R47  43.81,57.15 270 top
R48  43.81,46.99 90 top
R49  57.78,57.15 270 top
R50  57.78,46.99 90 top
R51  71.75,57.15 270 top
R52  71.75,46.99 90 top
R53  85.72,57.15 270 top
R54  85.72,46.99 90 top
R55  99.69,57.15 270 top
R56  99.69,46.99 90 top
R57  113.67,57.15 270 top
R58  113.67,46.99 90 top
R59  127.64,57.15 270 top
R60  127.64,46.99 90 top
R61  141.6,57.15 270 top
R62  141.6,46.99 90 top
S1  44.45,6.35 0 top
TP1  58.42,19.05 0 top
TP2  97.79,12.7 0 top
TP3  97.79,19.05 0 top

### Tracks (layer width: path | path; a pad name or v marks a point on that pad's centre or on a via)
+5V  (via drill 0.35, 0.5)
  Top 0.813: DIS5.1 DIS5.2 DIS5.3 DIS5.4 DIS5.5 DIS5.6 DIS5.7 DIS5.8 DIS5.9 DIS5.10 IC8.9 66.04,60.96 66.04,50.8 IC8.3 62.23,41.91 C40.1 | DIS1.1 DIS1.2 DIS1.3 DIS1.4 DIS1.5 DIS1.6 DIS1.7 DIS1.8 DIS1.9 DIS1.10 IC4.9 10.16,60.96 10.16,50.8 IC4.3 6.35,41.91 C36.1 3.81,36.83 R1.E 3.81,21.59 2.54,20.32 2.54,13.97 5.08,11.43 9.45,11.43 J2.1 20.32,7.62 26.67,13.97 C2.1 | DIS2.1 DIS2.2 DIS2.3 DIS2.4 DIS2.5 DIS2.6 DIS2.7 DIS2.8 DIS2.9 DIS2.10 IC5.9 24.13,60.96 24.13,50.8 IC5.3 20.32,41.91 C37.1 | DIS3.1 DIS3.2 DIS3.3 DIS3.4 DIS3.5 DIS3.6 DIS3.7 DIS3.8 DIS3.9 DIS3.10 IC6.9 38.1,60.96 38.1,50.8 IC6.3 34.29,41.91 C39.1 | DIS4.1 DIS4.2 DIS4.3 DIS4.4 DIS4.5 DIS4.6 DIS4.7 DIS4.8 DIS4.9 DIS4.10 IC7.9 52.07,60.96 52.07,50.8 IC7.3 48.26,41.91 C38.1 | DIS7.1 DIS7.2 DIS7.3 DIS7.4 DIS7.5 DIS7.6 DIS7.7 DIS7.8 DIS7.9 DIS7.10 IC10.9 93.98,60.96 93.98,50.8 IC10.3 90.17,41.91 C43.1 | DIS8.1 DIS8.2 DIS8.3 DIS8.4 DIS8.5 DIS8.6 DIS8.7 DIS8.8 DIS8.9 DIS8.10 IC11.9 107.95,60.96 107.95,50.8 IC11.3 104.14,41.91 C42.1 | DIS9.1 DIS9.2 DIS9.3 DIS9.4 DIS9.5 DIS9.6 DIS9.7 DIS9.8 DIS9.9 DIS9.10 IC12.9 121.92,60.96 121.92,50.8 IC12.3 118.11,41.91 C44.1 | DIS10.1 DIS10.2 DIS10.3 DIS10.4 DIS10.5 DIS10.6 DIS10.7 DIS10.8 DIS10.9 DIS10.10 IC13.9 135.89,60.96 135.89,50.8 IC13.3 132.08,41.91 C45.1 | C41.1 76.2,41.91 IC9.3 80.01,50.8 80.01,60.96 IC9.9 DIS6.10 DIS6.9 DIS6.8 DIS6.7 DIS6.6 DIS6.5 DIS6.4 DIS6.3 DIS6.2 DIS6.1 | C5.1 110.49,16.51 R16.2 105.41,15.24 v90.17,15.24 | IC1.4 45.72,11.43 50.8,6.35 v60.96,6.35 66.04,6.35 C4.1
  Bottom 0.813: IC3.4 124.46,13.97 123.19,15.24 114.3,15.24 C5.1 | v90.17,15.24 86.36,15.24 85.09,13.97 | 85.09,13.97 IC2.4 | C4.1 74.93,15.24 83.82,15.24 85.09,13.97 | v60.96,6.35 60.96,17.78 R4.2 | IC1.4 45.72,13.97 44.45,15.24 35.56,15.24 C2.1 | C36.1 7.62,40.64 19.05,40.64 C37.1 21.59,40.64 33.02,40.64 C39.1 35.56,40.64 46.99,40.64 C38.1 49.53,40.64 60.96,40.64 C40.1 63.5,40.64 74.93,40.64 C41.1 77.47,40.64 88.9,40.64 C43.1 91.44,40.64 102.87,40.64 C42.1 105.41,40.64 116.84,40.64 C44.1 119.38,40.64 130.81,40.64 C45.1 | TP3.TP 104.14,19.05 R16.2
GND  (73 unrouted)
  pour Bottom: -2.54,101.6 147.32,101.6 147.32,-2.54 -2.54,-2.54
  pour Top: -1.27,100.33 146.05,100.33 146.05,-1.27 -1.27,-1.27
N$1
  Top 0.406: J1.4 14.61,21.59 R2.1
N$2
  Bottom 0.406: R3.1 7.62,16.51 J1.2
N$3
  Top 0.406: R3.2 R2.2
  Bottom 0.406: IC1.5 48.26,15.24 46.99,16.51 35.56,16.51 34.29,17.78 24.13,17.78 R2.2
N$4
  Top 0.406: IC1.3 43.18,13.97 44.45,15.24 | 44.45,15.24 57.15,15.24 60.96,15.24 R4.1 R5.2 | 44.45,15.24 41.91,17.78 25.4,17.78 22.86,20.32 C1.-
N$5
  Top 0.406: IC1.2 40.64,11.43 39.37,10.16 R6.2 R8.1
N$6
  Top 0.406: R10.E 29.21,12.7 IC1.1
  Bottom 0.406: S1.1 41.91,8.89 IC1.1
N$7
  Bottom 0.406: IC6.15 35.56,53.34 35.56,63.5 29.84,69.22 29.84,79.38 DIS3.15
N$8
  Bottom 0.406: IC6.16 36.2,51.44 36.2,64.14 30.48,69.85 30.48,77.47 DIS3.14
N$9
  Bottom 0.406: IC6.17 36.83,49.53 36.83,64.77 31.11,70.48 31.11,75.56 DIS3.13
N$10
  Top 0.406: IC1.7 57.15,12.7 58.42,11.43 R11.E
  Bottom 0.406: S1.3 50.8,6.35 53.34,8.89 IC1.7
N$11
  Bottom 0.406: IC6.18 37.47,47.62 37.47,65.41 31.75,71.12 31.75,73.66 DIS3.12
N$12
  Bottom 0.406: S1.2 44.45,5.08 43.18,3.81 38.1,3.81 29.21,12.7 C3.+
N$13
  Bottom 0.406: R1.S 11.43,25.4 M1.2 17.78,26.67 C1.+
N$14
  Bottom 0.406: IC12.15 119.38,53.34 119.38,63.5 113.67,69.22 113.67,79.38 DIS9.15
N$15
  Bottom 0.406: IC12.16 120.02,51.44 120.02,64.14 114.3,69.85 114.3,77.47 DIS9.14
N$16
  Bottom 0.406: IC12.17 120.65,49.53 120.65,64.77 114.94,70.48 114.94,75.56 DIS9.13
N$17
  Bottom 0.406: IC6.1 38.1,45.72 38.1,67.31 DIS3.11
N$18
  Top 0.406: IC6.14 36.83,57.15 36.83,66.04 31.75,71.12 31.75,83.82 DIS3.16
N$19
  Top 0.406: IC6.13 36.2,59.05 36.2,65.41 31.11,70.48 31.11,85.72 DIS3.17
N$20
  Bottom 0.406: IC12.18 121.28,47.62 121.28,65.41 115.57,71.12 115.57,73.66 DIS9.12
N$21
  Bottom 0.406: IC12.1 121.92,45.72 121.92,67.31 DIS9.11
N$22
  Top 0.406: IC12.14 120.65,57.15 120.65,66.04 115.57,71.12 115.57,83.82 DIS9.16
N$23
  Top 0.406: IC12.13 120.02,59.05 120.02,65.41 114.94,70.48 114.94,85.72 DIS9.17
N$24
  Top 0.406: IC12.12 119.38,60.96 119.38,64.77 114.3,69.85 114.3,87.63 DIS9.18
N$25
  Top 0.406: IC12.11 118.75,62.87 118.75,64.14 113.67,69.22 113.67,89.53 DIS9.19
N$26
  Top 0.406: IC6.12 35.56,60.96 35.56,64.77 30.48,69.85 30.48,87.63 DIS3.18
N$27
  Top 0.406: IC6.11 34.92,62.87 34.92,64.14 29.84,69.22 29.84,89.53 DIS3.19
N$28
  Top 0.406: DIS3.20 29.21,91.44 29.21,67.31 IC6.10
N$29
  Top 0.406: IC6.7 IC6.6 43.18,53.34 R47.2
N$30
  Top 0.406: IC6.8 R47.1 45.09,59.69 45.09,52.07 R48.2
N$31
  Top 0.406: R10.S 29.21,2.54 R8.2
N$32
  Bottom 0.406: IC5.15 21.59,53.34 21.59,63.5 15.88,69.22 15.88,79.38 DIS2.15
N$33
  Bottom 0.406: IC5.16 22.23,51.44 22.23,64.14 16.51,69.85 16.51,77.47 DIS2.14
N$34
  Bottom 0.406: IC5.17 22.86,49.53 22.86,64.77 17.14,70.48 17.14,75.56 DIS2.13
N$35
  Bottom 0.406: IC5.18 23.5,47.62 23.5,65.41 17.78,71.12 17.78,73.66 DIS2.12
N$36
  Bottom 0.406: IC5.1 24.13,45.72 24.13,67.31 DIS2.11
N$37
  Top 0.406: DIS2.16 17.78,83.82 17.78,71.12 22.86,66.04 22.86,57.15 IC5.14
N$38
  Top 0.406: DIS2.17 17.14,85.72 17.14,70.48 22.23,65.41 22.23,59.05 IC5.13
N$39
  Top 0.406: DIS2.18 16.51,87.63 16.51,69.85 21.59,64.77 21.59,60.96 IC5.12
N$40
  Top 0.406: DIS2.19 15.88,89.53 15.88,69.22 20.95,64.14 20.95,62.87 IC5.11
N$41
  Top 0.406: DIS2.20 15.24,91.44 15.24,67.31 IC5.10
N$42
  Top 0.406: IC5.7 IC5.6 29.21,53.34 R45.2
N$43
  Top 0.406: IC5.8 R45.1 31.11,59.69 31.11,52.07 R46.2
N$44
  Top 0.406: R9.2 59.69,2.54 R11.S
N$45
  Bottom 0.406: IC7.15 49.53,53.34 49.53,63.5 43.81,69.22 43.81,79.38 DIS4.15
N$46
  Bottom 0.406: IC7.16 50.16,51.44 50.16,64.14 44.45,69.85 44.45,77.47 DIS4.14
N$47
  Bottom 0.406: IC7.17 50.8,49.53 50.8,64.77 45.09,70.48 45.09,75.56 DIS4.13
N$48
  Bottom 0.406: IC7.18 51.44,47.62 51.44,65.41 45.72,71.12 45.72,73.66 DIS4.12
N$49
  Bottom 0.406: IC7.1 52.07,45.72 52.07,67.31 DIS4.11
N$50
  Top 0.406: IC7.14 50.8,57.15 50.8,66.04 45.72,71.12 45.72,83.82 DIS4.16
N$51
  Top 0.406: IC7.13 50.16,59.05 50.16,65.41 45.09,70.48 45.09,85.72 DIS4.17
N$52
  Top 0.406: IC7.12 49.53,60.96 49.53,64.77 44.45,69.85 44.45,87.63 DIS4.18
N$53
  Top 0.406: IC7.11 48.9,62.87 48.9,64.14 43.81,69.22 43.81,89.53 DIS4.19
N$54
  Top 0.406: IC7.10 43.18,67.31 43.18,91.44 DIS4.20
N$55
  Top 0.406: IC7.7 IC7.6 57.15,53.34 R49.2
N$56
  Top 0.406: IC7.8 R49.1 59.05,59.69 59.05,52.07 R50.2
N$58
  Bottom 0.406: IC8.15 63.5,53.34 63.5,63.5 57.78,69.22 57.78,79.38 DIS5.15
N$59
  Bottom 0.406: IC8.16 64.14,51.44 64.14,64.14 58.42,69.85 58.42,77.47 DIS5.14
N$60
  Bottom 0.406: IC8.17 64.77,49.53 64.77,64.77 59.05,70.48 59.05,75.56 DIS5.13
N$61
  Bottom 0.406: IC8.18 65.41,47.62 65.41,65.41 59.69,71.12 59.69,73.66 DIS5.12
N$62
  Bottom 0.406: IC8.1 66.04,45.72 66.04,67.31 DIS5.11
N$63
  Top 0.406: IC8.14 64.77,57.15 64.77,66.04 59.69,71.12 59.69,83.82 DIS5.16
N$64
  Top 0.406: IC8.13 64.14,59.05 64.14,65.41 59.05,70.48 59.05,85.72 DIS5.17
N$65
  Top 0.406: IC8.12 63.5,60.96 63.5,64.77 58.42,69.85 58.42,87.63 DIS5.18
N$66
  Top 0.406: IC8.11 62.87,62.87 62.87,64.14 57.78,69.22 57.78,89.53 DIS5.19
N$67
  Top 0.406: IC8.10 57.15,67.31 57.15,91.44 DIS5.20
N$68
  Top 0.406: IC8.7 IC8.6 71.12,53.34 R51.2
N$69
  Top 0.406: IC8.8 R51.1 73.03,59.69 73.03,52.07 R52.2
N$71
  Bottom 0.406: IC10.15 91.44,53.34 91.44,63.5 85.72,69.22 85.72,79.38 DIS7.15
N$72
  Bottom 0.406: IC10.16 92.08,51.44 92.08,64.14 86.36,69.85 86.36,77.47 DIS7.14
N$73
  Bottom 0.406: IC10.17 92.71,49.53 92.71,64.77 87,70.48 87,75.56 DIS7.13
N$74
  Bottom 0.406: IC10.18 93.34,47.62 93.34,65.41 87.63,71.12 87.63,73.66 DIS7.12
N$75
  Bottom 0.406: IC10.1 93.98,45.72 93.98,67.31 DIS7.11
N$76
  Top 0.406: IC10.14 92.71,57.15 92.71,66.04 87.63,71.12 87.63,83.82 DIS7.16
N$77
  Top 0.406: IC10.13 92.08,59.05 92.08,65.41 87,70.48 87,85.72 DIS7.17
N$78
  Top 0.406: IC10.12 91.44,60.96 91.44,64.77 86.36,69.85 86.36,87.63 DIS7.18
N$79
  Top 0.406: IC10.11 90.81,62.87 90.81,64.14 85.72,69.22 85.72,89.53 DIS7.19
N$80
  Top 0.406: IC10.10 85.09,67.31 85.09,91.44 DIS7.20
N$81
  Top 0.406: IC10.7 IC10.6 99.06,53.34 R55.2
N$82
  Top 0.406: IC10.8 R55.1 100.97,59.69 100.97,52.07 R56.2
N$84
  Bottom 0.406: IC9.15 77.47,53.34 77.47,63.5 71.75,69.22 71.75,79.38 DIS6.15
N$85
  Bottom 0.406: IC9.16 78.11,51.44 78.11,64.14 72.39,69.85 72.39,77.47 DIS6.14
N$86
  Bottom 0.406: IC9.17 78.74,49.53 78.74,64.77 73.03,70.48 73.03,75.56 DIS6.13
N$87
  Bottom 0.406: IC9.18 79.38,47.62 79.38,65.41 73.66,71.12 73.66,73.66 DIS6.12
N$88
  Bottom 0.406: IC9.1 80.01,45.72 80.01,67.31 DIS6.11
N$89
  Top 0.406: IC9.14 78.74,57.15 78.74,66.04 73.66,71.12 73.66,83.82 DIS6.16
N$90
  Top 0.406: IC9.13 78.11,59.05 78.11,65.41 73.03,70.48 73.03,85.72 DIS6.17
N$91
  Top 0.406: IC9.12 77.47,60.96 77.47,64.77 72.39,69.85 72.39,87.63 DIS6.18
N$92
  Top 0.406: IC9.11 76.83,62.87 76.83,64.14 71.75,69.22 71.75,89.53 DIS6.19
N$93
  Top 0.406: IC9.10 71.12,67.31 71.12,91.44 DIS6.20
N$94
  Top 0.406: IC9.7 IC9.6 85.09,53.34 R53.2
N$95
  Top 0.406: IC9.8 R53.1 87,59.69 87,52.07 R54.2
N$97
  Bottom 0.406: IC4.15 7.62,53.34 7.62,63.5 1.91,69.22 1.91,79.38 DIS1.15
N$98
  Bottom 0.406: IC4.16 8.26,51.44 8.26,64.14 2.54,69.85 2.54,77.47 DIS1.14
N$99
  Bottom 0.406: IC4.17 8.89,49.53 8.89,64.77 3.17,70.48 3.17,75.56 DIS1.13
N$100
  Bottom 0.406: IC4.18 9.53,47.62 9.53,65.41 3.81,71.12 3.81,73.66 DIS1.12
N$101
  Bottom 0.406: IC4.1 10.16,45.72 10.16,67.31 DIS1.11
N$102
  Top 0.406: IC4.14 8.89,57.15 8.89,66.04 3.81,71.12 3.81,83.82 DIS1.16
N$103
  Top 0.406: IC4.13 8.26,59.05 8.26,65.41 3.17,70.48 3.17,85.72 DIS1.17
N$104
  Top 0.406: IC4.12 7.62,60.96 7.62,64.77 2.54,69.85 2.54,87.63 DIS1.18
N$105
  Top 0.406: IC4.11 6.99,62.87 6.99,64.14 1.91,69.22 1.91,89.53 DIS1.19
N$106
  Top 0.406: IC4.10 1.27,67.31 1.27,91.44 DIS1.20
N$107
  Top 0.406: IC4.7 IC4.6 15.24,53.34 R43.2
N$108
  Top 0.406: IC4.8 R43.1 17.14,59.69 17.14,52.07 R44.2
N$110
  Bottom 0.406: IC11.15 105.41,53.34 105.41,63.5 99.69,69.22 99.69,79.38 DIS8.15
N$111
  Bottom 0.406: IC11.16 106.05,51.44 106.05,64.14 100.33,69.85 100.33,77.47 DIS8.14
N$112
  Bottom 0.406: IC11.17 106.68,49.53 106.68,64.77 100.97,70.48 100.97,75.56 DIS8.13
N$113
  Bottom 0.406: IC11.18 107.31,47.62 107.31,65.41 101.6,71.12 101.6,73.66 DIS8.12
N$114
  Bottom 0.406: DIS8.11 107.95,67.31 107.95,45.72 IC11.1
N$115
  Top 0.406: IC11.14 106.68,57.15 106.68,66.04 101.6,71.12 101.6,83.82 DIS8.16
N$116
  Top 0.406: IC11.13 106.05,59.05 106.05,65.41 100.97,70.48 100.97,85.72 DIS8.17
N$117
  Top 0.406: IC11.12 105.41,60.96 105.41,64.77 100.33,69.85 100.33,87.63 DIS8.18
N$118
  Top 0.406: IC11.11 104.78,62.87 104.78,64.14 99.69,69.22 99.69,89.53 DIS8.19
N$119
  Top 0.406: IC11.10 99.06,67.31 99.06,91.44 DIS8.20
N$120
  Top 0.406: IC11.7 IC11.6 113.03,53.34 R57.2
N$121
  Top 0.406: IC11.8 R57.1 114.94,59.69 114.94,52.07 R58.2
N$123
  Top 0.406: IC1.6 R7.2 R9.1
N$125
  Top 0.406: C16.2 R27.2 76.2,8.89 77.47,10.16 IC2.1
  Bottom 0.406: R27.2 71.12,21.59 66.04,26.67 66.04,30.48 64.77,31.75 39.37,31.75 36.83,34.29 D3.A
N$126
  Top 0.406: IC12.10 113.03,67.31 113.03,91.44 DIS9.20
N$127
  Top 0.406: IC12.7 IC12.6 127,53.34 R59.2
N$128
  Top 0.406: R60.2 128.91,52.07 128.91,59.69 R59.1 IC12.8
N$130
  Top 0.406: IC2.2 80.01,10.16 R27.1 C12.2
N$131
  Bottom 0.406: IC13.15 133.35,53.34 133.35,63.5 127.64,69.22 127.64,79.38 DIS10.15
N$132
  Bottom 0.406: IC13.16 133.99,51.44 133.99,64.14 128.27,69.85 128.27,77.47 DIS10.14
N$133
  Top 0.406: IC1.8 53.34,22.86 54.61,24.13 R17.2 C8.2
  Bottom 0.406: D1.A 8.89,34.29 11.43,31.75 17.78,31.75 20.32,29.21 58.42,29.21 C8.2
N$134
  Top 0.406: IC1.9 50.8,22.86 R17.1 C6.2
N$135  (via drill 0.35)
  Top 0.406: IC2.14 77.47,22.86 76.2,24.13 R30.2 C19.2 v76.2,27.94
  Bottom 0.406: v76.2,27.94 D6.A
N$136
  Top 0.406: R14.2 C6.1 C8.1 R12.2
N$138
  Top 0.406: IC1.14 38.1,22.86 36.83,24.13 R18.2 C9.2 24.13,27.94 20.32,31.75 D2.A
N$139
  Top 0.406: C7.2 R18.1 40.64,22.86 IC1.13
N$140
  Top 0.406: R23.2 C12.1 C16.1 R19.2
N$141
  Top 0.406: R15.2 C7.1 C9.1 R13.2
N$144
  Top 0.406: IC2.7 92.71,10.16 93.98,8.89 R28.2 C17.2
  Bottom 0.406: IC2.7 92.71,15.24 91.44,16.51 76.2,16.51 74.93,17.78 74.93,30.48 72.39,33.02 52.07,33.02 50.8,34.29 D4.A
N$145
  Top 0.406: IC2.6 90.17,10.16 R28.1 C13.2
N$146
  Top 0.406: C15.2 R30.1 80.01,22.86 IC2.13
N$147
  Top 0.406: R24.2 C13.1 C17.1 R20.2
N$149
  Top 0.406: IC2.8 92.71,22.86 93.98,24.13 R29.2 C18.2 97.79,29.21 86.36,29.21 82.55,33.02 66.04,33.02 64.77,34.29 D5.A
N$150
  Top 0.406: IC2.9 90.17,22.86 R29.1 C14.2
N$151
  Top 0.406: IC3.1 116.84,10.16 115.57,8.89 R39.2 C28.2
  Bottom 0.406: R39.2 110.49,21.59 106.68,25.4 99.06,25.4 95.25,29.21 95.25,31.75 92.71,34.29 D8.A
N$152
  Top 0.406: R25.2 C14.1 C18.1 R21.2
N$154
  Top 0.406: R22.2 C19.1 C15.1 R26.2
N$156
  Top 0.406: IC3.2 119.38,10.16 R39.1 C24.2
N$157
  Top 0.406: R31.2 C28.1 C24.1 R35.2
N$159
  Top 0.406: C29.2 R40.2 133.35,8.89 132.08,10.16 IC3.7
  Bottom 0.406: IC3.7 132.08,15.24 130.81,16.51 118.11,16.51 114.3,20.32 114.3,22.86 110.49,26.67 107.95,26.67 104.14,30.48 D9.A
N$160
  Top 0.406: IC3.6 129.54,10.16 R40.1 C25.2
N$161
  Top 0.406: R36.2 C25.1 C29.1 R32.2
N$163
  Top 0.406: C30.2 R41.2 133.35,24.13 132.08,22.86 IC3.8
  Bottom 0.406: IC3.8 132.08,25.4 130.81,26.67 127,26.67 124.46,29.21 124.46,31.75 121.92,34.29 D10.A
N$164
  Top 0.406: IC3.9 129.54,22.86 R41.1 C26.2
N$165
  Top 0.406: R37.2 C26.1 C30.1 R33.2
N$167
  Top 0.406: IC3.14 116.84,22.86 115.57,24.13 | 115.57,24.13 R42.2 C31.2 | 115.57,24.13 115.57,27.94 116.84,29.21 123.19,29.21 128.27,34.29 D11.A
N$168
  Top 0.406: IC3.13 119.38,22.86 R42.1 C27.2
N$169
  Top 0.406: R34.2 C31.1 C27.1 R38.2
N$171
  Bottom 0.406: IC13.17 134.62,49.53 134.62,64.77 128.91,70.48 128.91,75.56 DIS10.13
N$172
  Bottom 0.406: IC13.18 135.25,47.62 135.25,65.41 129.54,71.12 129.54,73.66 DIS10.12
N$173
  Bottom 0.406: IC13.1 135.89,45.72 135.89,67.31 DIS10.11
N$174
  Top 0.406: IC13.14 134.62,57.15 134.62,66.04 129.54,71.12 129.54,83.82 DIS10.16
N$175
  Top 0.406: IC13.13 133.99,59.05 133.99,65.41 128.91,70.48 128.91,85.72 DIS10.17
N$176
  Top 0.406: IC13.12 133.35,60.96 133.35,64.77 128.27,69.85 128.27,87.63 DIS10.18
N$177
  Top 0.406: IC13.11 132.72,62.87 132.72,64.14 127.64,69.22 127.64,89.53 DIS10.19
N$178
  Top 0.406: DIS10.20 127,91.44 127,67.31 IC13.10
N$179
  Top 0.406: IC13.7 IC13.6 140.97,53.34 R61.2
N$180
  Top 0.406: IC13.8 R61.1 142.88,59.69 142.88,52.07 R62.2
OUT1
  Top 0.406: IC4.5 14.61,51.44 14.61,38.73 C10.+ D1.C
OUT2
  Top 0.406: IC5.5 28.57,51.44 28.57,38.73 C11.+ D2.C
OUT3
  Top 0.406: IC6.5 42.55,51.44 42.55,38.73 C20.+ D3.C
OUT4
  Top 0.406: IC7.5 56.52,51.44 56.52,38.73 C21.+ D4.C
OUT5
  Top 0.406: IC8.5 70.48,51.44 70.48,38.73 C22.+ D5.C
OUT6
  Top 0.406: IC9.5 84.45,51.44 84.45,38.73 C23.+ D6.C
OUT7
  Top 0.406: IC10.5 98.42,51.44 98.42,38.73 C32.+ D8.C
OUT8
  Top 0.406: IC11.5 112.39,51.44 112.39,38.73 C33.+ D9.C
OUT9
  Top 0.406: IC12.5 126.36,51.44 126.36,38.73 C34.+ D10.C
OUT10
  Top 0.406: IC13.5 140.34,51.44 140.34,38.73 C35.+ D11.C
REF
  Top 0.406: D7.A 134.62,16.51 128.27,16.51 | 128.27,16.51 123.19,16.51 | 88.9,16.51 83.82,16.51 | 83.82,16.51 49.53,16.51 | 49.53,16.51 44.45,16.51 43.18,17.78 IC1.12 | IC1.10 48.26,17.78 49.53,16.51 | IC2.12 82.55,17.78 83.82,16.51 | IC2.10 87.63,17.78 88.9,16.51 | IC2.3 82.55,15.24 83.82,16.51 | IC2.5 87.63,15.24 88.9,16.51 | IC3.3 121.92,15.24 123.19,16.51 | IC3.12 121.92,17.78 | 121.92,17.78 123.19,16.51 | IC3.10 127,17.78 128.27,16.51 | IC3.5 127,15.24 128.27,16.51 | 88.9,16.51 R16.1 100.33,17.78 121.92,17.78
VER
  Top 0.406: R22.1 R12.1 62.23,22.86 TP1.TP | R21.1 R34.1 | R20.1 R31.1 | R33.1 R32.1 | R13.1 29.21,21.59 C3.-
  Bottom 0.406: R32.1 139.7,7.62 109.22,7.62 R31.1 107.95,11.43 107.95,21.59 R34.1 | R20.1 100.33,7.62 69.85,7.62 R19.1 64.77,12.7 64.77,21.59 R12.1 60.96,25.4 30.48,25.4 R13.1

### Text on the board
tNames: 32 Hz | 64 Hz | 128 Hz | 256 Hz | 512 Hz | 1 kHz | 2 kHz | 4 kHz | 8 kHz | 16 kHz | 5V
bNames: von Jakob Holz | Audio Spektrum Analyzer